# Altium schematic sheet Sheet_1.schdoc
size 605 x 619 mm
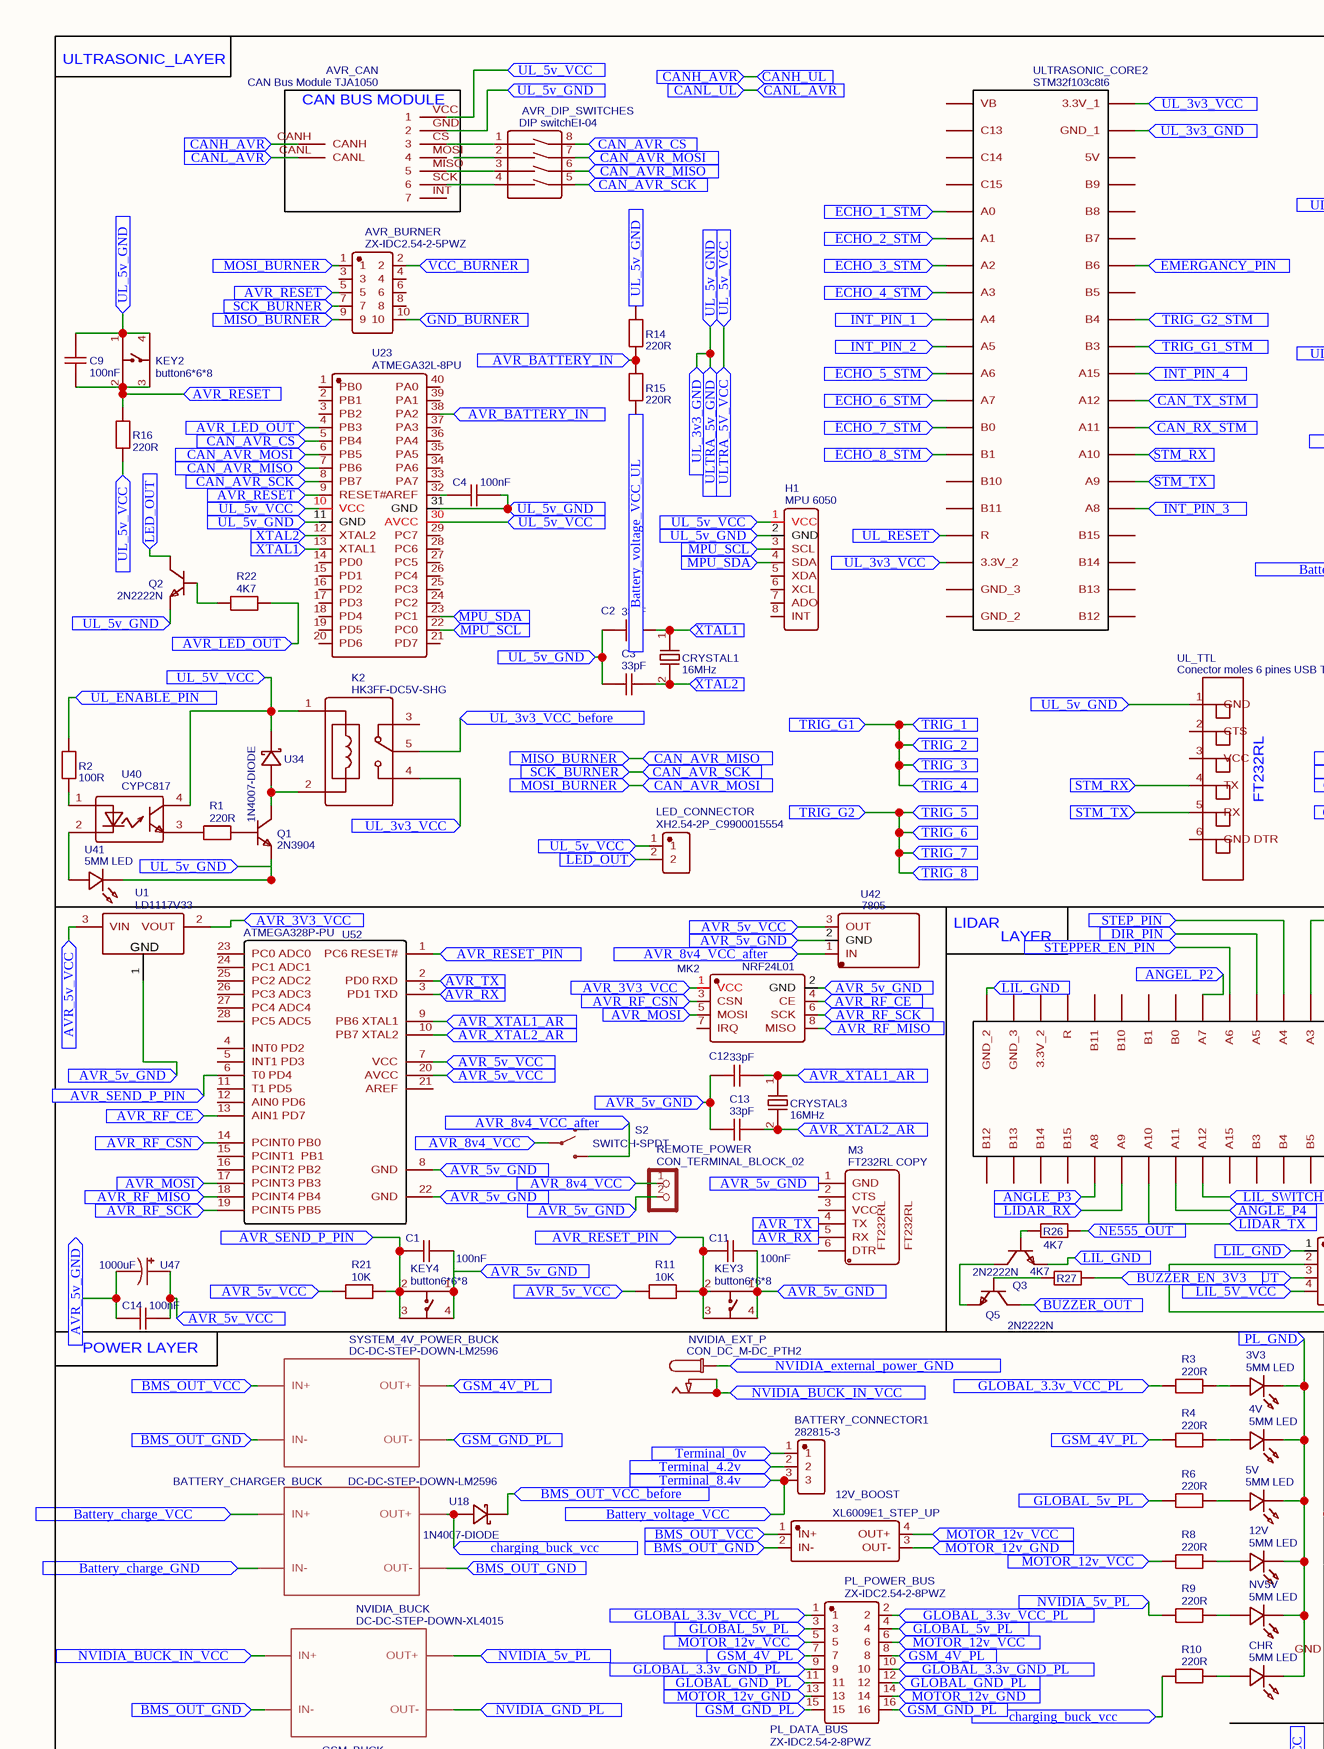
[diagram p0: Sheet_1.schdoc, top left]
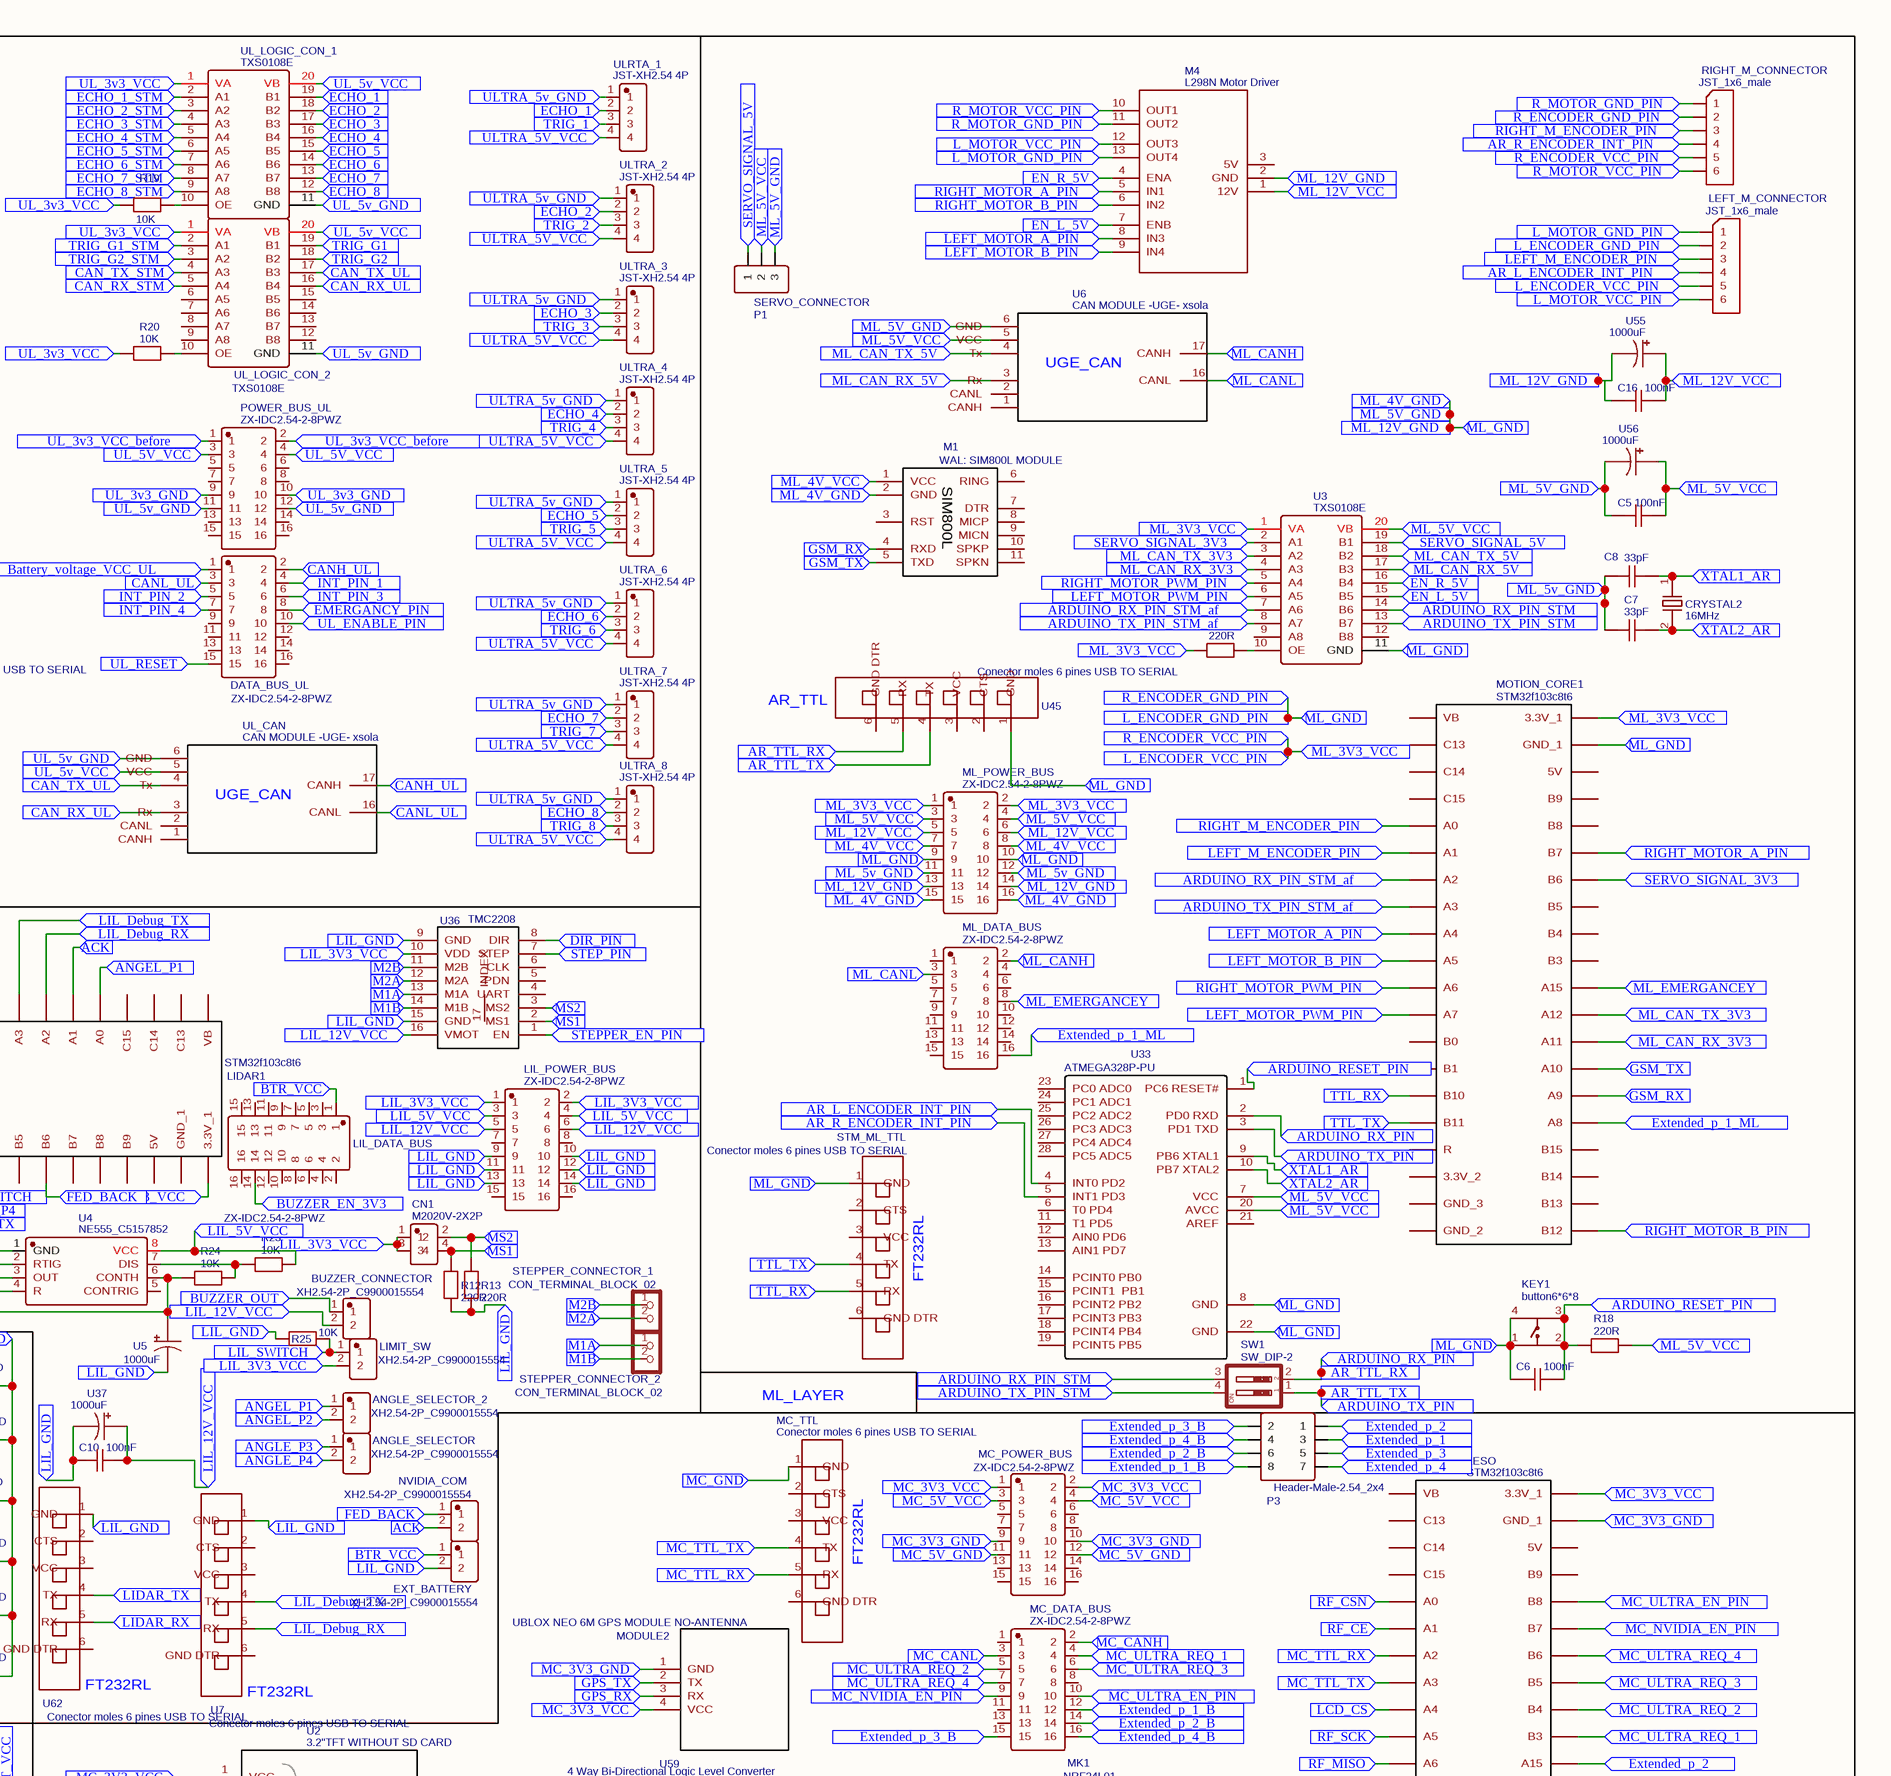
[diagram p1: Sheet_1.schdoc, top right]
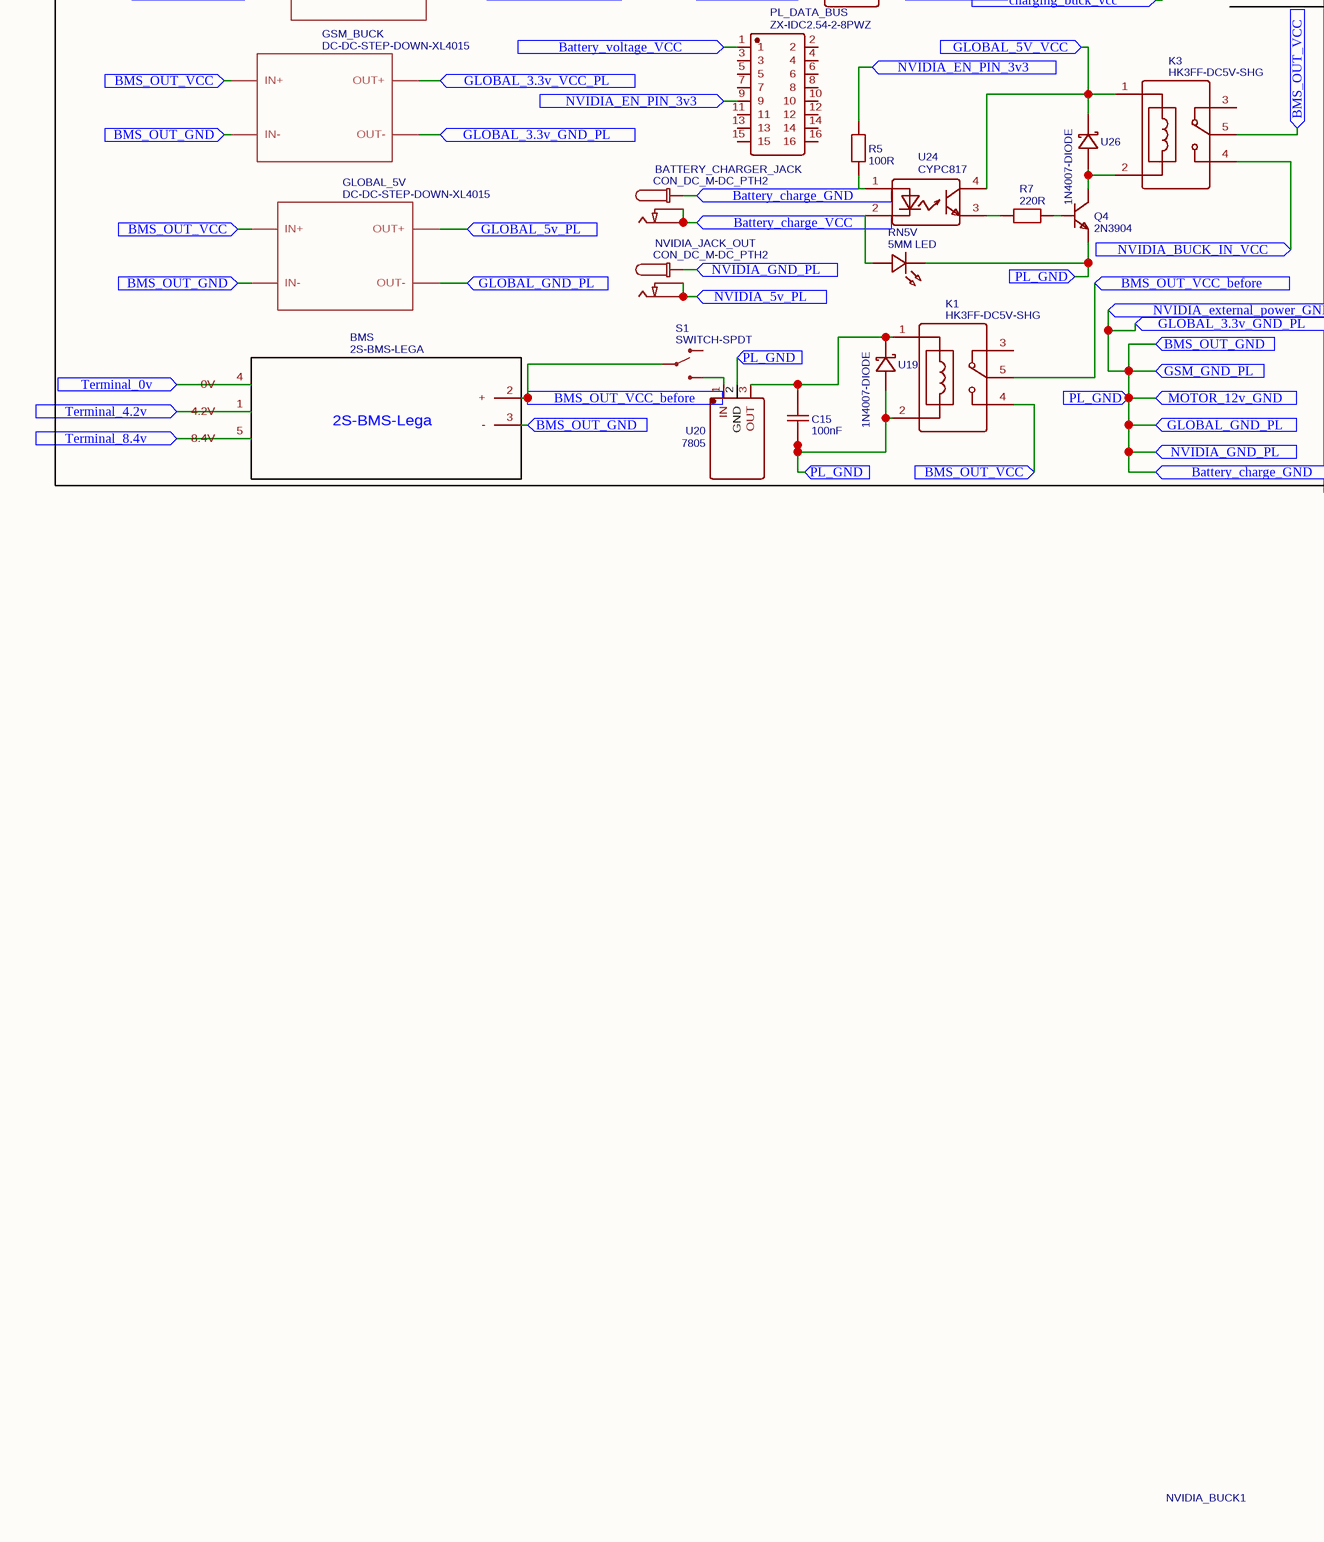
[diagram p2: Sheet_1.schdoc, bottom left]
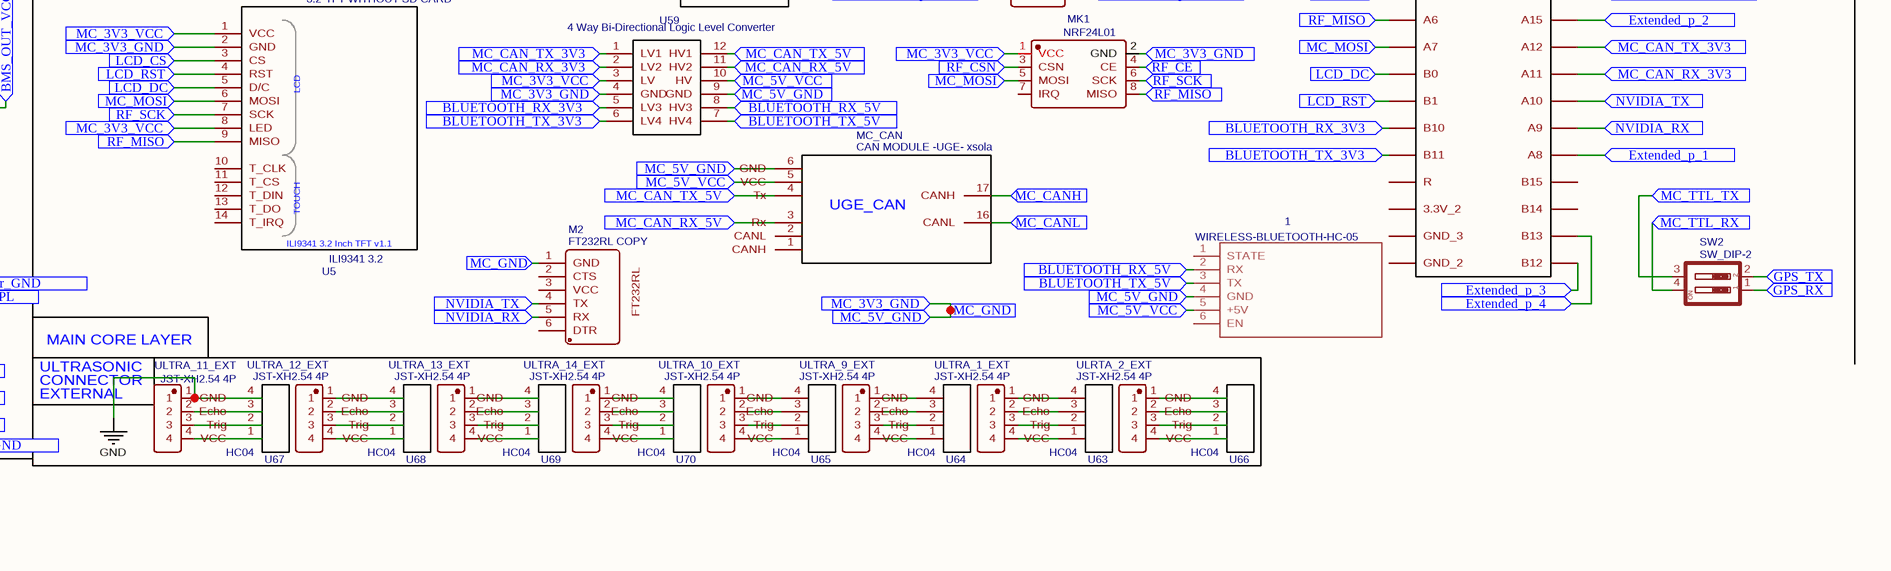
[diagram p3: Sheet_1.schdoc, bottom right]

## Parts
1  WIRELESS-BLUETOOTH-HC-05  [WIRELESS-BLUETOOTH-HC-05]
3V3  5MM LED  [LED-TH_BD5.0-P2.54-FD]
4V  5MM LED  [LED-TH_BD5.0-P2.54-FD]
5V  5MM LED  [LED-TH_BD5.0-P2.54-FD]
12V  5MM LED  [LED-TH_BD5.0-P2.54-FD]
12V_BOOST  XL6009E1_STEP_UP  [XL6009E1_STEP_UP]
ANGLE_SELECTOR  XH2.54-2P_C9900015554  [CONN-TH_XH2.54-2P]
ANGLE_SELECTOR_2  XH2.54-2P_C9900015554  [CONN-TH_XH2.54-2P]
AVR_BURNER  ZX-IDC2.54-2-5PWZ  [IDC-TH_10P-P2.54_ZX-IDC2.54-2-5PWZ]
AVR_CAN  CAN Bus Module TJA1050  [MCP2515_CAN_MODULE_BY0-10]
AVR_DIP_SWITCHES  DIP switchEI-04  [SW-TH_DIPSWITCHEI-04]
BATTERY_CHARGER_BUCK  DC-DC-STEP-DOWN-LM2596  [DC-DC-STEP-DOWN-LM2596]
BATTERY_CHARGER_JACK  CON_DC_M-DC_PTH2  [DC_BARREL_JACK_PTH_2MM_2]
BATTERY_CONNECTOR1  282815-3  [CONN-TH_3P-P5.08_TE_282815-3]
BMS  2S-BMS-LEGA  [2S_BMS_LEGA]
BUZZER_CONNECTOR  XH2.54-2P_C9900015554  [CONN-TH_XH2.54-2P]
C1  100nF  [CAP-TH_L3.8-W2.5-P2.54-D0.5]
C2  33pF  [CAP-TH_L3.8-W2.5-P2.54-D0.5]
C3  33pF  [CAP-TH_L3.8-W2.5-P2.54-D0.5]
C4  100nF  [CAP-TH_L3.8-W2.5-P2.54-D0.5]
C5  100nF  [CAP-TH_L3.8-W2.5-P2.54-D0.5]
C6  100nF  [CAP-TH_L3.8-W2.5-P2.54-D0.5]
C7  33pF  [CAP-TH_L3.8-W2.5-P2.54-D0.5]
C8  33pF  [CAP-TH_L3.8-W2.5-P2.54-D0.5]
C9  100nF  [CAP-TH_L3.8-W2.5-P2.54-D0.5]
C10  100nF  [CAP-TH_L3.8-W2.5-P2.54-D0.5]
C11  100nF  [CAP-TH_L3.8-W2.5-P2.54-D0.5]
C12  33pF  [CAP-TH_L3.8-W2.5-P2.54-D0.5]
C13  33pF  [CAP-TH_L3.8-W2.5-P2.54-D0.5]
C14  100nF  [CAP-TH_L3.8-W2.5-P2.54-D0.5]
C15  100nF  [CAP-TH_L3.8-W2.5-P2.54-D0.5]
C16  100nF  [CAP-TH_L3.8-W2.5-P2.54-D0.5]
CHR  5MM LED  [LED-TH_BD5.0-P2.54-FD]
CN1  M2020V-2X2P  [CONN-TH_M2020V-2X2P]
CRYSTAL1  16MHz  [CRYSTAL-TH_L10.8-W4.5-P4.88]
CRYSTAL2  16MHz  [CRYSTAL-TH_L10.8-W4.5-P4.88]
CRYSTAL3  16MHz  [CRYSTAL-TH_L10.8-W4.5-P4.88]
DATA_BUS_UL  ZX-IDC2.54-2-8PWZ  [IDC-TH_16P-P2.54_ZX-IDC2.54-2-8PWZ]
EXT_BATTERY  XH2.54-2P_C9900015554  [CONN-TH_XH2.54-2P]
GLOBAL_5V  DC-DC-STEP-DOWN-XL4015  [DC-DC-STEP-DOWN-XL4015]
GSM_BUCK  DC-DC-STEP-DOWN-XL4015  [DC-DC-STEP-DOWN-XL4015]
H1  MPU 6050  [MPU6050]
K1  HK3FF-DC5V-SHG  [RELAY-TH_HK3FF-DCXXV-1C]
K2  HK3FF-DC5V-SHG  [RELAY-TH_HK3FF-DCXXV-1C]
K3  HK3FF-DC5V-SHG  [RELAY-TH_HK3FF-DCXXV-1C]
KEY1  button6*6*8  [KEY-TH_4P-L6.0-W6.0-P4.50-LS7.5]
KEY2  button6*6*8  [KEY-TH_4P-L6.0-W6.0-P4.50-LS7.5]
KEY3  button6*6*8  [KEY-TH_4P-L6.0-W6.0-P4.50-LS7.5]
KEY4  button6*6*8  [KEY-TH_4P-L6.0-W6.0-P4.50-LS7.5]
LED_CONNECTOR  XH2.54-2P_C9900015554  [CONN-TH_XH2.54-2P]
LEFT_M_CONNECTOR  JST_1x6_male  [JST_XH_6PIN_2.54]
LESO  STM32f103c8t6  [STM32F103C8T6]
LIDAR1  STM32f103c8t6  [STM32F103C8T6]
LIL_DATA_BUS  ZX-IDC2.54-2-8PWZ  [IDC-TH_16P-P2.54_ZX-IDC2.54-2-8PWZ]
LIL_POWER_BUS  ZX-IDC2.54-2-8PWZ  [IDC-TH_16P-P2.54_ZX-IDC2.54-2-8PWZ]
LIMIT_SW  XH2.54-2P_C9900015554  [CONN-TH_XH2.54-2P]
M1  WAL: SIM800L MODULE  [WAL: SIM800L MODULE K]
M2  FT232RL COPY  [FT232RL]
M3  FT232RL COPY  [FT232RL]
M4  L298N Motor Driver  [L298N NI]
MC_CAN  CAN MODULE -UGE- xsola  [CAN MODULE -UGE-]
MC_DATA_BUS  ZX-IDC2.54-2-8PWZ  [IDC-TH_16P-P2.54_ZX-IDC2.54-2-8PWZ]
MC_POWER_BUS  ZX-IDC2.54-2-8PWZ  [IDC-TH_16P-P2.54_ZX-IDC2.54-2-8PWZ]
MC_TTL  Conector moles 6 pines USB TO SERIAL  [CONECTRO MOLEX 6 PINES FT232RL]
MK1  NRF24L01  [WIRELM-SMD_NRF24L01]
MK2  NRF24L01  [WIRELM-SMD_NRF24L01]
ML_DATA_BUS  ZX-IDC2.54-2-8PWZ  [IDC-TH_16P-P2.54_ZX-IDC2.54-2-8PWZ]
ML_POWER_BUS  ZX-IDC2.54-2-8PWZ  [IDC-TH_16P-P2.54_ZX-IDC2.54-2-8PWZ]
MODULE2  UBLOX NEO 6M GPS MODULE NO-ANTENNA  [UBLOX NEO 6M GPS MODULE]
MOTION_CORE1  STM32f103c8t6  [STM32F103C8T6]
NV5V  5MM LED  [LED-TH_BD5.0-P2.54-FD]
NVIDIA_BUCK  DC-DC-STEP-DOWN-XL4015  [DC-DC-STEP-DOWN-XL4015]
NVIDIA_COM  XH2.54-2P_C9900015554  [CONN-TH_XH2.54-2P]
NVIDIA_EXT_P  CON_DC_M-DC_PTH2  [DC_BARREL_JACK_PTH_2MM_2]
NVIDIA_JACK_OUT  CON_DC_M-DC_PTH2  [DC_BARREL_JACK_PTH_2MM_2]
P1  SERVO_CONNECTOR  [HDR-TH_3P-P2.54-V-F]
P3  Header-Male-2.54_2x4  [HDR-TH_8P-P2.54-V-M-R2-C4-S2.54]
PL_DATA_BUS  ZX-IDC2.54-2-8PWZ  [IDC-TH_16P-P2.54_ZX-IDC2.54-2-8PWZ]
PL_POWER_BUS  ZX-IDC2.54-2-8PWZ  [IDC-TH_16P-P2.54_ZX-IDC2.54-2-8PWZ]
POWER_BUS_UL  ZX-IDC2.54-2-8PWZ  [IDC-TH_16P-P2.54_ZX-IDC2.54-2-8PWZ]
Q1  2N3904  [TO-92-3_L5.1-W4.1-P1.27-L]
Q2  2N2222N  [2N2222N]
Q3  2N2222N  [2N2222N]
Q4  2N3904  [TO-92-3_L5.1-W4.1-P1.27-L]
Q5  2N2222N  [2N2222N]
R1  220R  [1/4 WATT RESISTOR]
R2  100R  [1/4 WATT RESISTOR]
R3  220R  [1/4 WATT RESISTOR]
R4  220R  [1/4 WATT RESISTOR]
R5  100R  [1/4 WATT RESISTOR]
R6  220R  [1/4 WATT RESISTOR]
R7  220R  [1/4 WATT RESISTOR]
R8  220R  [1/4 WATT RESISTOR]
R9  220R  [1/4 WATT RESISTOR]
R10  220R  [1/4 WATT RESISTOR]
R11  10K  [1/4 WATT RESISTOR]
R12  220R  [1/4 WATT RESISTOR]
R13  220R  [1/4 WATT RESISTOR]
R14  220R  [1/4 WATT RESISTOR]
R15  220R  [1/4 WATT RESISTOR]
R16  220R  [1/4 WATT RESISTOR]
R17  220R  [1/4 WATT RESISTOR]
R18  220R  [1/4 WATT RESISTOR]
R19  10K  [1/4 WATT RESISTOR]
R20  10K  [1/4 WATT RESISTOR]
R21  10K  [1/4 WATT RESISTOR]
R22  4K7  [1/4 WATT RESISTOR]
R23  10K  [1/4 WATT RESISTOR]
R24  10K  [1/4 WATT RESISTOR]
R25  10K  [1/4 WATT RESISTOR]
R26  4K7  [1/4 WATT RESISTOR]
R27  4K7  [1/4 WATT RESISTOR]
REMOTE_POWER  CON_TERMINAL_BLOCK_02  [TERMINAL_BLOCK_2P_5]
RIGHT_M_CONNECTOR  JST_1x6_male  [JST_XH_6PIN_2.54]
RN5V  5MM LED  [LED-TH_BD5.0-P2.54-FD]
S1  SWITCH-SPDT  [SWITCH-SPDT_KIT]
S2  SWITCH-SPDT  [SWITCH-SPDT_KIT]
STEPPER_CONNECTOR_1  CON_TERMINAL_BLOCK_02  [TERMINAL_BLOCK_2P_5]
STEPPER_CONNECTOR_2  CON_TERMINAL_BLOCK_02  [TERMINAL_BLOCK_2P_5]
STM_ML_TTL  Conector moles 6 pines USB TO SERIAL  [CONECTRO MOLEX 6 PINES FT232RL]
SW1  SW_DIP-2  [DIPSWITCH-02]
SW2  SW_DIP-2  [DIPSWITCH-02]
SYSTEM_4V_POWER_BUCK  DC-DC-STEP-DOWN-LM2596  [DC-DC-STEP-DOWN-LM2596]
U1  LD1117V33  [TO-220-3_L10.0-W4.5-P2.54-L]
U2  3.2"TFT WITHOUT SD CARD  [3.2INCH TFT MODIFIED]
U3  TXS0108E  [TXS0108E]
U4  NE555_C5157852  [DIP-8_L9.8-W6.4-P2.54-LS7.6-BL]
U5  1000uF  [CAP-TH_BD10.0-P5.00-D1.0-FD]
U6  CAN MODULE -UGE- xsola  [CAN MODULE -UGE-]
U7  Conector moles 6 pines USB TO SERIAL  [CONECTRO MOLEX 6 PINES FT232RL]
U18  1N4007-DIODE  [DO-41_BD2.4-L4.7-P8.70-D0.8-FD]
U19  1N4007-DIODE  [DO-41_BD2.4-L4.7-P8.70-D0.8-FD]
U20  7805  [TO-220-3_L10.0-W4.5-P2.54-L]
U23  ATMEGA32L-8PU  [PDIP-40_L52.3-W13.8-P2.54-LS15.2-BL]
U24  CYPC817  [DIP-4_L6.4-W4.6-P2.54-LS7.6-BL]
U26  1N4007-DIODE  [DO-41_BD2.4-L4.7-P8.70-D0.8-FD]
U33  ATMEGA328P-PU  [DIP-28_L34.6-W7.3-P2.54-LS10.2-BL]
U34  1N4007-DIODE  [DO-41_BD2.4-L4.7-P8.70-D0.8-FD]
U36  TMC2208  [TMC2208]
U37  1000uF  [CAP-TH_BD10.0-P5.00-D1.0-FD]
U40  CYPC817  [DIP-4_L6.4-W4.6-P2.54-LS7.6-BL]
U41  5MM LED  [LED-TH_BD5.0-P2.54-FD]
U42  7805  [TO-220-3_L10.0-W4.5-P2.54-L]
U45  Conector moles 6 pines USB TO SERIAL  [CONECTRO MOLEX 6 PINES FT232RL]
U47  1000uF  [CAP-TH_BD10.0-P5.00-D1.0-FD]
U52  ATMEGA328P-PU  [DIP-28_L34.6-W7.3-P2.54-LS10.2-BL]
U55  1000uF  [CAP-TH_BD10.0-P5.00-D1.0-FD]
U56  1000uF  [CAP-TH_BD10.0-P5.00-D1.0-FD]
U59  4 Way Bi-Directional Logic Level Converter  [LOGIC_LEVEL_CONVERTER_BI_DIRECT_4_CH]
U62  Conector moles 6 pines USB TO SERIAL  [CONECTRO MOLEX 6 PINES FT232RL]
U63  HC04  [HC04 HEADER]
U64  HC04  [HC04 HEADER]
U65  HC04  [HC04 HEADER]
U66  HC04  [HC04 HEADER]
U67  HC04  [HC04 HEADER]
U68  HC04  [HC04 HEADER]
U69  HC04  [HC04 HEADER]
U70  HC04  [HC04 HEADER]
UL_CAN  CAN MODULE -UGE- xsola  [CAN MODULE -UGE-]
UL_LOGIC_CON_1  TXS0108E  [TXS0108E]
UL_LOGIC_CON_2  TXS0108E  [TXS0108E]
UL_TTL  Conector moles 6 pines USB TO SERIAL  [CONECTRO MOLEX 6 PINES FT232RL]
ULRTA_1  JST-XH2.54 4P  [JST-XH2.54 4P]
ULRTA_2_EXT  JST-XH2.54 4P  [JST-XH2.54 4P]
ULTRA_1_EXT  JST-XH2.54 4P  [JST-XH2.54 4P]
ULTRA_2  JST-XH2.54 4P  [JST-XH2.54 4P]
ULTRA_3  JST-XH2.54 4P  [JST-XH2.54 4P]
ULTRA_4  JST-XH2.54 4P  [JST-XH2.54 4P]
ULTRA_5  JST-XH2.54 4P  [JST-XH2.54 4P]
ULTRA_6  JST-XH2.54 4P  [JST-XH2.54 4P]
ULTRA_7  JST-XH2.54 4P  [JST-XH2.54 4P]
ULTRA_8  JST-XH2.54 4P  [JST-XH2.54 4P]
ULTRA_9_EXT  JST-XH2.54 4P  [JST-XH2.54 4P]
ULTRA_10_EXT  JST-XH2.54 4P  [JST-XH2.54 4P]
ULTRA_11_EXT  JST-XH2.54 4P  [JST-XH2.54 4P]
ULTRA_12_EXT  JST-XH2.54 4P  [JST-XH2.54 4P]
ULTRA_13_EXT  JST-XH2.54 4P  [JST-XH2.54 4P]
ULTRA_14_EXT  JST-XH2.54 4P  [JST-XH2.54 4P]
ULTRASONIC_CORE2  STM32f103c8t6  [STM32F103C8T6]

## Blocks framed on the sheet
ULTRASONIC_LAYER: AVR_BURNER AVR_CAN AVR_DIP_SWITCHES C2-C4 C9 CRYSTAL1 DATA_BUS_UL H1 K2 KEY2 LED_CONNECTOR POWER_BUS_UL Q1 Q2 R1 R2 R14-R16 R19 R20 R22 U23 U34 U40 U41 UL_CAN UL_LOGIC_CON_1 UL_LOGIC_CON_2 UL_TTL ULRTA_1 ULTRA_2-ULTRA_8 ULTRASONIC_CORE2
ML_LAYER: C5-C8 C16 CRYSTAL2 KEY1 LEFT_M_CONNECTOR M1 M4 ML_DATA_BUS ML_POWER_BUS MOTION_CORE1 P1 R17 R18 RIGHT_M_CONNECTOR STM_ML_TTL SW1 U3 U6 U33 U45 U55 U56
POWER LAYER: 3V3 4V 5V 12V 12V_BOOST BATTERY_CHARGER_BUCK BATTERY_CHARGER_JACK BATTERY_CONNECTOR1 BMS C15 CHR GLOBAL_5V GSM_BUCK K1 K3 NV5V NVIDIA_BUCK NVIDIA_EXT_P NVIDIA_JACK_OUT PL_DATA_BUS PL_POWER_BUS Q4 R3-R10 RN5V S1 SYSTEM_4V_POWER_BUCK U18-U20 U24 U26

## Ports
ACK (in), ANGEL_P1 (in), ANGEL_P2 (in), ANGLE_P3 (in), ANGLE_P4 (in), AR_L_ENCODER_INT_PIN (in), AR_R_ENCODER_INT_PIN (in), AR_TTL_RX (in), AR_TTL_TX (in), ARDUINO_RESET_PIN (in), ARDUINO_RX_PIN (in), ARDUINO_RX_PIN_STM (in), ARDUINO_RX_PIN_STM_af (in), ARDUINO_TX_PIN (in), ARDUINO_TX_PIN_STM (in), ARDUINO_TX_PIN_STM_af (in), AVR_3V3_VCC (in), AVR_5v_GND (in), AVR_5v_VCC (in), AVR_8v4_VCC (in), AVR_8v4_VCC_after (in), AVR_BATTERY_IN (in), AVR_LED_OUT (in), AVR_MOSI (in), AVR_RESET (in), AVR_RESET_PIN (in), AVR_RF_CE (in), AVR_RF_CSN (in), AVR_RF_MISO (in), AVR_RF_SCK (in), AVR_RX (in), AVR_SEND_P_PIN (in), AVR_TX (in), AVR_XTAL1_AR (in), AVR_XTAL2_AR (in), Battery_charge_GND (in), Battery_charge_VCC (in), Battery_voltage_VCC (in), Battery_voltage_VCC_UL (in), BLUETOOTH_RX_3V3 (in), BLUETOOTH_RX_5V (in), BLUETOOTH_TX_3V3 (in), BLUETOOTH_TX_5V (in), BMS_OUT_GND (in), BMS_OUT_VCC (in), BMS_OUT_VCC_before (in), BTR_VCC (in), BUZZER_EN_3V3 (in), BUZZER_OUT (in), CAN_AVR_CS (in), CAN_AVR_MISO (in), CAN_AVR_MOSI (in), CAN_AVR_SCK (in), CAN_RX_STM (in), CAN_RX_UL (in), CAN_TX_STM (in), CAN_TX_UL (in), CANH_AVR (in), CANH_UL (in), CANL_AVR (in), CANL_UL (in), charging_buck_vcc (in), DIR_PIN (in), ECHO_1 (in), ECHO_1_STM (in), ECHO_2 (in), ECHO_2_STM (in), ECHO_3 (in), ECHO_3_STM (in), ECHO_4 (in), ECHO_4_STM (in), ECHO_5 (in), ECHO_5_STM (in), ECHO_6 (in), ECHO_6_STM (in), ECHO_7 (in), ECHO_7_STM (in), ECHO_8 (in), ECHO_8_STM (in), EMERGANCY_PIN (in), EN_L_5V (in), EN_R_5V (in), Extended_p_1 (in), Extended_p_1_B (in), Extended_p_1_ML (in), Extended_p_2 (in), Extended_p_2_B (in), Extended_p_3 (in), Extended_p_3_B (in), Extended_p_4 (in), Extended_p_4_B (in), FED_BACK (in), GLOBAL_3.3v_GND_PL (in), GLOBAL_3.3v_VCC_PL (in), GLOBAL_5v_PL (in), GLOBAL_5V_VCC (in), GLOBAL_GND_PL (in), GND_BURNER (in), GPS_RX (in), GPS_TX (in), GSM_4V_PL (in), GSM_GND_PL (in), GSM_RX (in), GSM_TX (in), INT_PIN_1 (in), INT_PIN_2 (in), INT_PIN_3 (in), INT_PIN_4 (in), L_ENCODER_GND_PIN (in), L_ENCODER_VCC_PIN (in), L_MOTOR_GND_PIN (in), L_MOTOR_VCC_PIN (in), LCD_CS (in), LCD_DC (in), LCD_RST (in), LED_OUT (in), LEFT_M_ENCODER_PIN (in), LEFT_MOTOR_A_PIN (in), LEFT_MOTOR_B_PIN (in), LEFT_MOTOR_PWM_PIN (in), LIDAR_RX (in), LIDAR_TX (in), LIL_3V3_VCC (in), LIL_5V_VCC (in), LIL_12V_VCC (in), LIL_Debug_RX (in), LIL_Debug_TX (in), LIL_GND (in), LIL_SWITCH (in), M1A (in), M1B (in), M2A (in), M2B (in), MC_3V3_GND (in), MC_3V3_VCC (in), MC_5V_GND (in), MC_5V_VCC (in), MC_CAN_RX_3V3 (in), MC_CAN_RX_5V (in), MC_CAN_TX_3V3 (in), MC_CAN_TX_5V (in), MC_CANH (in), MC_CANL (in), MC_GND (in), MC_MOSI (in), MC_NVIDIA_EN_PIN (in), MC_TTL_RX (in), MC_TTL_TX (in), MC_ULTRA_EN_PIN (in), MC_ULTRA_REQ_1 (in), MC_ULTRA_REQ_2 (in), MC_ULTRA_REQ_3 (in), MC_ULTRA_REQ_4 (in), MISO_BURNER (in), ML_3V3_VCC (in), ML_4V_GND (in), ML_4V_VCC (in), ML_5V_GND (in), ML_5v_GND (in), ML_5V_VCC (in), ML_12V_GND (in), ML_12V_VCC (in), ML_CAN_RX_3V3 (in), ML_CAN_RX_5V (in), ML_CAN_TX_3V3 (in), ML_CAN_TX_5V (in), ML_CANH (in), ML_CANL (in), ML_EMERGANCEY (in), ML_GND (in), MOSI_BURNER (in), MOTOR_12v_GND (in), MOTOR_12v_VCC (in), MPU_SCL (in), MPU_SDA (in), MS1 (in), MS2 (in), NE555_OUT (in), NVIDIA_5v_PL (in), NVIDIA_BUCK_IN_VCC (in), NVIDIA_EN_PIN_3v3 (in), NVIDIA_external_power_GND (in), NVIDIA_GND_PL (in), NVIDIA_RX (in), NVIDIA_TX (in), PL_GND (in), R_ENCODER_GND_PIN (in), R_ENCODER_VCC_PIN (in), R_MOTOR_GND_PIN (in), R_MOTOR_VCC_PIN (in), RF_CE (in), RF_CSN (in), RF_MISO (in), RF_SCK (in), RIGHT_M_ENCODER_PIN (in), RIGHT_MOTOR_A_PIN (in), RIGHT_MOTOR_B_PIN (in), RIGHT_MOTOR_PWM_PIN (in), SCK_BURNER (in), SERVO_SIGNAL_3V3 (in), SERVO_SIGNAL_5V (in), STEP_PIN (in), STEPPER_EN_PIN (in), STM_RX (in), STM_TX (in), Terminal_0v (in), Terminal_4.2v (in), Terminal_8.4v (in), TRIG_1 (in), TRIG_2 (in), TRIG_3 (in), TRIG_4 (in), TRIG_5 (in), TRIG_6 (in), TRIG_7 (in), TRIG_8 (in), TRIG_G1 (in), TRIG_G1_STM (in), TRIG_G2 (in), TRIG_G2_STM (in), TTL_RX (in), TTL_TX (in), UL_3v3_GND (in), UL_3v3_VCC (in), UL_3v3_VCC_before (in), UL_5v_GND (in), UL_5v_VCC (in), UL_5V_VCC (in), UL_ENABLE_PIN (in), UL_RESET (in), ULTRA_5v_GND (in), ULTRA_5V_VCC (in), VCC_BURNER (in), XTAL1 (in), XTAL1_AR (in), XTAL2 (in), XTAL2_AR (in)

## Nets
GND: U67.4(GND) ULTRA_11_EXT.1
ACK: LIDAR1.A1 NVIDIA_COM.2 ; port ACK
ANGEL_P1: ANGLE_SELECTOR_2.1 LIDAR1.A0 ; port ANGEL_P1
ANGEL_P2: ANGLE_SELECTOR_2.2 LIDAR1.A7 ; port ANGEL_P2
ANGLE_P3: ANGLE_SELECTOR.1 LIDAR1.A8 ; port ANGLE_P3
ANGLE_P4: ANGLE_SELECTOR.2 LIDAR1.A11 ; port ANGLE_P4
AR_L_ENCODER_INT_PIN: LEFT_M_CONNECTOR.4 U33.4(INT0_PD2) ; port AR_L_ENCODER_INT_PIN
AR_R_ENCODER_INT_PIN: RIGHT_M_CONNECTOR.4 U33.5(INT1_PD3) ; port AR_R_ENCODER_INT_PIN
AR_TTL_RX: SW1.2 U33.2(PD0_RXD) U45.5(RX) ; port AR_TTL_RX, port ARDUINO_RX_PIN
AR_TTL_TX: SW1.1 U33.3(PD1_TXD) U45.4(TX) ; port AR_TTL_TX, port ARDUINO_TX_PIN
ARDUINO_RESET_PIN: C6.1 KEY1.2 KEY1.3 R18.2 U33.1(PC6_RESET#) ; port ARDUINO_RESET_PIN
ARDUINO_RX_PIN_STM: SW1.3 U3.14(B6) ; port ARDUINO_RX_PIN_STM
ARDUINO_RX_PIN_STM_af: MOTION_CORE1.A2 U3.7(A6) ; port ARDUINO_RX_PIN_STM_af
ARDUINO_TX_PIN_STM: SW1.4 U3.13(B7) ; port ARDUINO_TX_PIN_STM
ARDUINO_TX_PIN_STM_af: MOTION_CORE1.A3 U3.8(A7) ; port ARDUINO_TX_PIN_STM_af
AVR_3V3_VCC: MK2.1(VCC) U1.2(VOUT) ; port AVR_3V3_VCC
AVR_5v_GND: C1.1 C11.1 C12.2 C13.2 C14.2 KEY3.1 KEY3.4 KEY4.1 KEY4.4 M3.1(GND) MK2.2(GND) REMOTE_POWER.2 U1.1(GND) U42.2(GND) U47.2 U52.8(GND) U52.22(GND) ; port AVR_5v_GND
AVR_5v_VCC: C14.1 R11.1 R21.1 U1.3(VIN) U42.3(OUT) U47.1 U52.7(VCC) U52.20(AVCC) ; port AVR_5v_VCC
AVR_8v4_VCC: REMOTE_POWER.1 S2.2(P) ; port AVR_8v4_VCC
AVR_8v4_VCC_after: S2.3(S) U42.1(IN) ; port AVR_8v4_VCC_after
AVR_BATTERY_IN: R14.2 R15.1 U23.38(PA2) ; port AVR_BATTERY_IN
AVR_LED_OUT: R22.2 U23.4(PB3) ; port AVR_LED_OUT
AVR_MOSI: MK2.5(MOSI) U52.17(PCINT3_PB3) ; port AVR_MOSI
AVR_RESET: AVR_BURNER.5 C9.1 KEY2.2 KEY2.3 R16.1 U23.9(RESET#) ; port AVR_RESET
AVR_RESET_PIN: C11.2 KEY3.2 KEY3.3 R11.2 U52.1(PC6_RESET#) ; port AVR_RESET_PIN
AVR_RF_CE: MK2.4(CE) U52.13(AIN1_PD7) ; port AVR_RF_CE
AVR_RF_CSN: MK2.3(CSN) U52.14(PCINT0_PB0) ; port AVR_RF_CSN
AVR_RF_MISO: MK2.8(MISO) U52.18(PCINT4_PB4) ; port AVR_RF_MISO
AVR_RF_SCK: MK2.6(SCK) U52.19(PCINT5_PB5) ; port AVR_RF_SCK
AVR_RX: M3.5(RX) U52.3(PD1_TXD) ; port AVR_RX
AVR_SEND_P_PIN: C1.2 KEY4.2 KEY4.3 R21.2 U52.6(T0_PD4) ; port AVR_SEND_P_PIN
AVR_TX: M3.4(TX) U52.2(PD0_RXD) ; port AVR_TX
AVR_XTAL1_AR: C12.1 CRYSTAL3.1 U52.9(PB6_XTAL1) ; port AVR_XTAL1_AR
AVR_XTAL2_AR: C13.1 CRYSTAL3.2 U52.10(PB7_XTAL2) ; port AVR_XTAL2_AR
Battery_charge_GND: 3V3.2(-) 4V.2(-) 5V.2(-) 12V.2(-) 12V_BOOST.2(IN-) 12V_BOOST.3(OUT-) BATTERY_CHARGER_BUCK.IN- BATTERY_CHARGER_BUCK.OUT- BATTERY_CHARGER_JACK.P1 BMS.3(-) C15.1 CHR.2(-) GLOBAL_5V.IN- GLOBAL_5V.OUT- GSM_BUCK.IN- GSM_BUCK.OUT- K1.2 NV5V.2(-) NVIDIA_BUCK.IN- NVIDIA_BUCK.OUT- NVIDIA_EXT_P.P1 NVIDIA_JACK_OUT.P1 PL_POWER_BUS.9 PL_POWER_BUS.10 PL_POWER_BUS.11 PL_POWER_BUS.12 PL_POWER_BUS.13 PL_POWER_BUS.14 PL_POWER_BUS.15 PL_POWER_BUS.16 Q4.1(E) RN5V.2(-) SYSTEM_4V_POWER_BUCK.IN- SYSTEM_4V_POWER_BUCK.OUT- U19.1(A) U20.2(GND) ; port BMS_OUT_GND, port Battery_charge_GND, port NVIDIA_GND_PL, port GLOBAL_3.3v_GND_PL, port GLOBAL_GND_PL, port MOTOR_12v_GND, port PL_GND, port GSM_GND_PL, port NVIDIA_external_power_GND
Battery_charge_VCC: BATTERY_CHARGER_BUCK.IN+ BATTERY_CHARGER_JACK.P2(P3) BATTERY_CHARGER_JACK.P3(P2) ; port Battery_charge_VCC
Battery_voltage_VCC: BATTERY_CONNECTOR1.3 BMS.5(8.4V) PL_DATA_BUS.1 ; port Terminal_8.4v, port Battery_voltage_VCC
Battery_voltage_VCC_UL: DATA_BUS_UL.1 R15.2 ; port Battery_voltage_VCC_UL
BLUETOOTH_RX_3V3: LESO.B10 U59.5(LV3) ; port BLUETOOTH_RX_3V3
BLUETOOTH_RX_5V: 1.2(RX) U59.8(HV3) ; port BLUETOOTH_RX_5V
BLUETOOTH_TX_3V3: LESO.B11 U59.6(LV4) ; port BLUETOOTH_TX_3V3
BLUETOOTH_TX_5V: 1.3(TX) U59.7(HV4) ; port BLUETOOTH_TX_5V
BMS_OUT_VCC: 12V_BOOST.1(IN+) GLOBAL_5V.IN+ GSM_BUCK.IN+ K1.4 K3.5 SYSTEM_4V_POWER_BUCK.IN+ ; port BMS_OUT_VCC
BMS_OUT_VCC_before: BMS.2(+) K1.5 S1.2(P) U18.2(K) ; port BMS_OUT_VCC_before
BTR_VCC: EXT_BATTERY.1 LIL_DATA_BUS.1 ; port BTR_VCC
BUZZER_EN_3V3: LIL_DATA_BUS.14 R27.2 ; port BUZZER_EN_3V3
BUZZER_OUT: BUZZER_CONNECTOR.1 Q5.3(C) ; port BUZZER_OUT
CAN_AVR_CS: AVR_DIP_SWITCHES.8 U23.5(PB4) ; port CAN_AVR_CS
CAN_AVR_MISO: AVR_BURNER.9 AVR_DIP_SWITCHES.6 U23.7(PB6) ; port MISO_BURNER, port CAN_AVR_MISO
CAN_AVR_MOSI: AVR_BURNER.1 AVR_DIP_SWITCHES.7 U23.6(PB5) ; port MOSI_BURNER, port CAN_AVR_MOSI
CAN_AVR_SCK: AVR_BURNER.7 AVR_DIP_SWITCHES.5 U23.8(PB7) ; port SCK_BURNER, port CAN_AVR_SCK
CAN_RX_STM: UL_LOGIC_CON_2.5(A4) ULTRASONIC_CORE2.A11 ; port CAN_RX_STM
CAN_RX_UL: UL_CAN.3(Rx) UL_LOGIC_CON_2.16(B4) ; port CAN_RX_UL
CAN_TX_STM: UL_LOGIC_CON_2.4(A3) ULTRASONIC_CORE2.A12 ; port CAN_TX_STM
CAN_TX_UL: UL_CAN.4(Tx) UL_LOGIC_CON_2.17(B3) ; port CAN_TX_UL
CANH_AVR: AVR_CAN.CANH DATA_BUS_UL.2 UL_CAN.17(CANH) ; port CANH_UL, port CANH_AVR
CANL_AVR: AVR_CAN.CANL DATA_BUS_UL.3 UL_CAN.16(CANL) ; port CANL_UL, port CANL_AVR
charging_buck_vcc: BATTERY_CHARGER_BUCK.OUT+ R10.1 U18.1(A) ; port charging_buck_vcc
DIR_PIN: LIDAR1.A5 U36.8(DIR) ; port DIR_PIN
ECHO_1: UL_LOGIC_CON_1.19(B1) ULRTA_1.2 ; port ECHO_1
ECHO_1_STM: UL_LOGIC_CON_1.2(A1) ULTRASONIC_CORE2.A0 ; port ECHO_1_STM
ECHO_2: UL_LOGIC_CON_1.18(B2) ULTRA_2.2 ; port ECHO_2
ECHO_2_STM: UL_LOGIC_CON_1.3(A2) ULTRASONIC_CORE2.A1 ; port ECHO_2_STM
ECHO_3: UL_LOGIC_CON_1.17(B3) ULTRA_3.2 ; port ECHO_3
ECHO_3_STM: UL_LOGIC_CON_1.4(A3) ULTRASONIC_CORE2.A2 ; port ECHO_3_STM
ECHO_4: UL_LOGIC_CON_1.16(B4) ULTRA_4.2 ; port ECHO_4
ECHO_4_STM: UL_LOGIC_CON_1.5(A4) ULTRASONIC_CORE2.A3 ; port ECHO_4_STM
ECHO_5: UL_LOGIC_CON_1.15(B5) ULTRA_5.2 ; port ECHO_5
ECHO_5_STM: UL_LOGIC_CON_1.6(A5) ULTRASONIC_CORE2.A6 ; port ECHO_5_STM
ECHO_6: UL_LOGIC_CON_1.14(B6) ULTRA_6.2 ; port ECHO_6
ECHO_6_STM: UL_LOGIC_CON_1.7(A6) ULTRASONIC_CORE2.A7 ; port ECHO_6_STM
ECHO_7: UL_LOGIC_CON_1.13(B7) ULTRA_7.2 ; port ECHO_7
ECHO_7_STM: UL_LOGIC_CON_1.8(A7) ULTRASONIC_CORE2.B0 ; port ECHO_7_STM
ECHO_8: UL_LOGIC_CON_1.12(B8) ULTRA_8.2 ; port ECHO_8
ECHO_8_STM: UL_LOGIC_CON_1.9(A8) ULTRASONIC_CORE2.B1 ; port ECHO_8_STM
EMERGANCY_PIN: DATA_BUS_UL.8 ULTRASONIC_CORE2.B6 ; port EMERGANCY_PIN
EN_L_5V: M4.7(ENB) U3.15(B5) ; port EN_L_5V
EN_R_5V: M4.4(ENA) U3.16(B4) ; port EN_R_5V
Extended_p_1: LESO.A8 P3.3 ; port Extended_p_1
Extended_p_1_B: MC_DATA_BUS.12 P3.8 ; port Extended_p_1_B
Extended_p_1_ML: ML_DATA_BUS.16 MOTION_CORE1.A8 ; port Extended_p_1_ML
Extended_p_2: LESO.A15 P3.1 ; port Extended_p_2
Extended_p_2_B: MC_DATA_BUS.14 P3.6 ; port Extended_p_2_B
Extended_p_3: LESO.B12 P3.5 ; port Extended_p_3
Extended_p_3_B: MC_DATA_BUS.15 P3.2 ; port Extended_p_3_B
Extended_p_4: LESO.B13 P3.7 ; port Extended_p_4
Extended_p_4_B: MC_DATA_BUS.16 P3.4 ; port Extended_p_4_B
FED_BACK: LIDAR1.A12 LIDAR1.B6 LIMIT_SW.1 NVIDIA_COM.1 R25.2 ; port FED_BACK, port LIL_SWITCH
GLOBAL_3.3v_VCC_PL: GSM_BUCK.OUT+ PL_POWER_BUS.1 PL_POWER_BUS.2 R3.1 ; port GLOBAL_3.3v_VCC_PL
GLOBAL_5v_PL: GLOBAL_5V.OUT+ PL_POWER_BUS.3 PL_POWER_BUS.4 R6.1 ; port GLOBAL_5v_PL
GLOBAL_5V_VCC: K3.1 U24.4(COL) U26.2(K) ; port GLOBAL_5V_VCC
GND_BURNER: AVR_BURNER.10 ; port GND_BURNER
GPS_RX: MODULE2.3(RX) SW2.1 ; port GPS_RX
GPS_TX: MODULE2.2(TX) SW2.2 ; port GPS_TX
GSM_4V_PL: PL_POWER_BUS.7 PL_POWER_BUS.8 R4.1 SYSTEM_4V_POWER_BUCK.OUT+ ; port GSM_4V_PL
GSM_RX: M1.4(RXD) MOTION_CORE1.A9 ; port GSM_RX
GSM_TX: M1.5(TXD) MOTION_CORE1.A10 ; port GSM_TX
INT_PIN_1: DATA_BUS_UL.4 ULTRASONIC_CORE2.A4 ; port INT_PIN_1
INT_PIN_2: DATA_BUS_UL.5 ULTRASONIC_CORE2.A5 ; port INT_PIN_2
INT_PIN_3: DATA_BUS_UL.6 ULTRASONIC_CORE2.A8 ; port INT_PIN_3
INT_PIN_4: DATA_BUS_UL.7 ULTRASONIC_CORE2.A15 ; port INT_PIN_4
L_ENCODER_GND_PIN: C5.2 C6.2 C7.2 C8.2 C16.2 KEY1.1 KEY1.4 LEFT_M_CONNECTOR.2 M1.2(GND) M4.2(GND) ML_POWER_BUS.9 ML_POWER_BUS.10 ML_POWER_BUS.11 ML_POWER_BUS.12 ML_POWER_BUS.13 ML_POWER_BUS.14 ML_POWER_BUS.15 ML_POWER_BUS.16 MOTION_CORE1.GND_1 P1.3 RIGHT_M_CONNECTOR.2 STM_ML_TTL.1(GND) U3.11(GND) U6.6(GND) U33.8(GND) U33.22(GND) U45.1(GND) U55.2 U56.2 ; port R_ENCODER_GND_PIN, port L_ENCODER_GND_PIN, port ML_12V_GND, port ML_5V_GND, port ML_4V_GND, port ML_GND, port ML_5v_GND
L_ENCODER_VCC_PIN: LEFT_M_CONNECTOR.5 ML_POWER_BUS.1 ML_POWER_BUS.2 MOTION_CORE1.3.3V_1 R17.2 RIGHT_M_CONNECTOR.5 U3.1(VA) ; port R_ENCODER_VCC_PIN, port L_ENCODER_VCC_PIN, port ML_3V3_VCC
L_MOTOR_GND_PIN: LEFT_M_CONNECTOR.1 M4.13(OUT4) ; port L_MOTOR_GND_PIN
L_MOTOR_VCC_PIN: LEFT_M_CONNECTOR.6 M4.12(OUT3) ; port L_MOTOR_VCC_PIN
LCD_CS: LESO.A4 U2.3(CS) ; port LCD_CS
LCD_DC: LESO.B0 U2.5(D/C) ; port LCD_DC
LCD_RST: LESO.B1 U2.4(RST) ; port LCD_RST
LED_OUT: LED_CONNECTOR.2 Q2.3(C) ; port LED_OUT
LEFT_M_ENCODER_PIN: LEFT_M_CONNECTOR.3 MOTION_CORE1.A1 ; port LEFT_M_ENCODER_PIN
LEFT_MOTOR_A_PIN: M4.8(IN3) MOTION_CORE1.A4 ; port LEFT_MOTOR_A_PIN
LEFT_MOTOR_B_PIN: M4.9(IN4) MOTION_CORE1.A5 ; port LEFT_MOTOR_B_PIN
LEFT_MOTOR_PWM_PIN: MOTION_CORE1.A7 U3.6(A5) ; port LEFT_MOTOR_PWM_PIN
LIDAR_RX: LIDAR1.A9 U62.5(RX) ; port LIDAR_RX
LIDAR_TX: LIDAR1.A10 U62.4(TX) ; port LIDAR_TX
LIL_3V3_VCC: CN1.1 CN1.3 LIDAR1.3.3V_1 LIL_POWER_BUS.1 LIL_POWER_BUS.2 LIMIT_SW.2 U36.10(VDD) ; port LIL_3V3_VCC
LIL_5V_VCC: LIL_POWER_BUS.3 LIL_POWER_BUS.4 R23.2 U4.4(R) U4.8(VCC) ; port LIL_5V_VCC
LIL_12V_VCC: BUZZER_CONNECTOR.2 C10.1 LIL_POWER_BUS.5 LIL_POWER_BUS.6 U36.16(VMOT) U37.1 ; port LIL_12V_VCC
LIL_Debug_RX: LIDAR1.A2 U7.5(RX) ; port LIL_Debug_RX
LIL_Debug_TX: LIDAR1.A3 U7.4(TX) ; port LIL_Debug_TX
LIL_GND: C10.2 EXT_BATTERY.2 LIDAR1.GND_2 LIL_POWER_BUS.9 LIL_POWER_BUS.10 LIL_POWER_BUS.11 LIL_POWER_BUS.12 LIL_POWER_BUS.13 LIL_POWER_BUS.14 Q3.1(E) R12.2 R13.2 R25.1 U4.1(GND) U5.2 U7.1(GND) U36.9(GND) U36.15(GND) U37.2 U62.1(GND) ; port LIL_GND
M1A: STEPPER_CONNECTOR_2.1 U36.13(M1A) ; port M1A
M1B: STEPPER_CONNECTOR_2.2 U36.14(M1B) ; port M1B
M2A: STEPPER_CONNECTOR_1.2 U36.12(M2A) ; port M2A
M2B: STEPPER_CONNECTOR_1.1 U36.11(M2B) ; port M2B
MC_3V3_GND: 1.4(GND) LESO.GND_1 M2.1(GND) MC_CAN.6(GND) MC_POWER_BUS.9 MC_POWER_BUS.10 MC_POWER_BUS.11 MC_POWER_BUS.12 MC_TTL.1(GND) MK1.2(GND) MODULE2.1(GND) U2.2(GND) U59.4(GND) U59.9(GND) ; port MC_3V3_GND, port MC_5V_GND, port MC_GND
MC_3V3_VCC: LESO.3.3V_1 MC_POWER_BUS.1 MC_POWER_BUS.2 MK1.1(VCC) MODULE2.4(VCC) U2.1(VCC) U2.8(LED) U59.3(LV) ; port MC_3V3_VCC
MC_5V_VCC: 1.5(+5V) MC_CAN.5(VCC) MC_POWER_BUS.3 MC_POWER_BUS.4 U59.10(HV) ; port MC_5V_VCC
MC_CAN_RX_3V3: LESO.A11 U59.2(LV2) ; port MC_CAN_RX_3V3
MC_CAN_RX_5V: MC_CAN.3(Rx) U59.11(HV2) ; port MC_CAN_RX_5V
MC_CAN_TX_3V3: LESO.A12 U59.1(LV1) ; port MC_CAN_TX_3V3
MC_CAN_TX_5V: MC_CAN.4(Tx) U59.12(HV1) ; port MC_CAN_TX_5V
MC_CANH: MC_CAN.17(CANH) MC_DATA_BUS.2 ; port MC_CANH
MC_CANL: MC_CAN.16(CANL) MC_DATA_BUS.3 ; port MC_CANL
MC_MOSI: LESO.A7 MK1.5(MOSI) U2.6(MOSI) ; port MC_MOSI
MC_NVIDIA_EN_PIN: LESO.B7 MC_DATA_BUS.9 ; port MC_NVIDIA_EN_PIN
MC_TTL_RX: LESO.A2 MC_TTL.5(RX) SW2.4 ; port MC_TTL_RX
MC_TTL_TX: LESO.A3 MC_TTL.4(TX) SW2.3 ; port MC_TTL_TX
MC_ULTRA_EN_PIN: LESO.B8 MC_DATA_BUS.10 ; port MC_ULTRA_EN_PIN
MC_ULTRA_REQ_1: LESO.B3 MC_DATA_BUS.4 ; port MC_ULTRA_REQ_1
MC_ULTRA_REQ_2: LESO.B4 MC_DATA_BUS.5 ; port MC_ULTRA_REQ_2
MC_ULTRA_REQ_3: LESO.B5 MC_DATA_BUS.6 ; port MC_ULTRA_REQ_3
MC_ULTRA_REQ_4: LESO.B6 MC_DATA_BUS.7 ; port MC_ULTRA_REQ_4
ML_4V_VCC: M1.1(VCC) ML_POWER_BUS.7 ML_POWER_BUS.8 ; port ML_4V_VCC
ML_5V_VCC: C5.1 ML_POWER_BUS.3 ML_POWER_BUS.4 P1.2 R18.1 U3.20(VB) U6.5(VCC) U33.7(VCC) U33.20(AVCC) U56.1 ; port ML_5V_VCC
ML_12V_VCC: C16.1 M4.1(12V) ML_POWER_BUS.5 ML_POWER_BUS.6 U55.1 ; port ML_12V_VCC
ML_CAN_RX_3V3: MOTION_CORE1.A11 U3.4(A3) ; port ML_CAN_RX_3V3
ML_CAN_RX_5V: U3.17(B3) U6.3(Rx) ; port ML_CAN_RX_5V
ML_CAN_TX_3V3: MOTION_CORE1.A12 U3.3(A2) ; port ML_CAN_TX_3V3
ML_CAN_TX_5V: U3.18(B2) U6.4(Tx) ; port ML_CAN_TX_5V
ML_CANH: ML_DATA_BUS.2 U6.17(CANH) ; port ML_CANH
ML_CANL: ML_DATA_BUS.3 U6.16(CANL) ; port ML_CANL
ML_EMERGANCEY: ML_DATA_BUS.8 MOTION_CORE1.A15 ; port ML_EMERGANCEY
MOTOR_12v_VCC: 12V_BOOST.4(OUT+) PL_POWER_BUS.5 PL_POWER_BUS.6 R8.1 ; port MOTOR_12v_VCC
MPU_SCL: H1.3(SCL) U23.22(PC0) ; port MPU_SCL
MPU_SDA: H1.4(SDA) U23.23(PC1) ; port MPU_SDA
MS1: CN1.4 R12.1 U36.2(MS1) ; port MS1
MS2: CN1.2 R13.1 U36.3(MS2) ; port MS2
NE555_OUT: R26.2 U4.3(OUT) ; port NE555_OUT
NVIDIA_5v_PL: NVIDIA_BUCK.OUT+ NVIDIA_JACK_OUT.P2(P3) NVIDIA_JACK_OUT.P3(P2) R9.1 ; port NVIDIA_5v_PL
NVIDIA_BUCK_IN_VCC: K3.4 NVIDIA_BUCK.IN+ NVIDIA_EXT_P.P2(P3) NVIDIA_EXT_P.P3(P2) ; port NVIDIA_BUCK_IN_VCC
NVIDIA_EN_PIN_3v3: PL_DATA_BUS.9 R5.1 ; port NVIDIA_EN_PIN_3v3
NVIDIA_RX: LESO.A9 M2.5(RX) ; port NVIDIA_RX
NVIDIA_TX: LESO.A10 M2.4(TX) ; port NVIDIA_TX
R_MOTOR_GND_PIN: M4.11(OUT2) RIGHT_M_CONNECTOR.1 ; port R_MOTOR_GND_PIN
R_MOTOR_VCC_PIN: M4.10(OUT1) RIGHT_M_CONNECTOR.6 ; port R_MOTOR_VCC_PIN
RF_CE: LESO.A1 MK1.4(CE) ; port RF_CE
RF_CSN: LESO.A0 MK1.3(CSN) ; port RF_CSN
RF_MISO: LESO.A6 MK1.8(MISO) U2.9(MISO) ; port RF_MISO
RF_SCK: LESO.A5 MK1.6(SCK) U2.7(SCK) ; port RF_SCK
RIGHT_M_ENCODER_PIN: MOTION_CORE1.A0 RIGHT_M_CONNECTOR.3 ; port RIGHT_M_ENCODER_PIN
RIGHT_MOTOR_A_PIN: M4.5(IN1) MOTION_CORE1.B7 ; port RIGHT_MOTOR_A_PIN
RIGHT_MOTOR_B_PIN: M4.6(IN2) MOTION_CORE1.B12 ; port RIGHT_MOTOR_B_PIN
RIGHT_MOTOR_PWM_PIN: MOTION_CORE1.A6 U3.5(A4) ; port RIGHT_MOTOR_PWM_PIN
SERVO_SIGNAL_3V3: MOTION_CORE1.B6 U3.2(A1) ; port SERVO_SIGNAL_3V3
SERVO_SIGNAL_5V: P1.1 U3.19(B1) ; port SERVO_SIGNAL_5V
STEP_PIN: LIDAR1.A4 U36.7(STEP) ; port STEP_PIN
STEPPER_EN_PIN: LIDAR1.A6 U36.1(EN) ; port STEPPER_EN_PIN
STM_RX: UL_TTL.4(TX) ULTRASONIC_CORE2.A10 ; port STM_RX
STM_TX: UL_TTL.5(RX) ULTRASONIC_CORE2.A9 ; port STM_TX
Terminal_0v: BATTERY_CONNECTOR1.1 BMS.4(0V) ; port Terminal_0v
Terminal_4.2v: BATTERY_CONNECTOR1.2 BMS.1(4.2V) ; port Terminal_4.2v
TRIG_1: UL_LOGIC_CON_2.19(B1) ULRTA_1.3 ULTRA_2.3 ULTRA_3.3 ULTRA_4.3 ; port TRIG_1, port TRIG_2, port TRIG_3, port TRIG_4, port TRIG_G1
TRIG_5: UL_LOGIC_CON_2.18(B2) ULTRA_5.3 ULTRA_6.3 ULTRA_7.3 ULTRA_8.3 ; port TRIG_5, port TRIG_6, port TRIG_7, port TRIG_8, port TRIG_G2
TRIG_G1_STM: UL_LOGIC_CON_2.2(A1) ULTRASONIC_CORE2.B3 ; port TRIG_G1_STM
TRIG_G2_STM: UL_LOGIC_CON_2.3(A2) ULTRASONIC_CORE2.B4 ; port TRIG_G2_STM
TTL_RX: MOTION_CORE1.B10 STM_ML_TTL.5(RX) ; port TTL_RX
TTL_TX: MOTION_CORE1.B11 STM_ML_TTL.4(TX) ; port TTL_TX
UL_3v3_GND: AVR_CAN.GND(2) C2.2 C3.2 C4.1 C9.2 H1.2(GND) KEY2.1 KEY2.4 POWER_BUS_UL.9 POWER_BUS_UL.10 POWER_BUS_UL.11 POWER_BUS_UL.12 Q1.1(E) Q2.1(E) R14.1 U23.11(GND) U23.31(GND) U41.2(-) UL_CAN.6(GND) UL_LOGIC_CON_1.11(GND) UL_LOGIC_CON_2.11(GND) UL_TTL.1(GND) ULRTA_1.1 ULTRA_2.1 ULTRA_3.1 ULTRA_4.1 ULTRA_5.1 ULTRA_6.1 ULTRA_7.1 ULTRA_8.1 ULTRASONIC_CORE2.GND_1 ; port ULTRA_5v_GND, port UL_5v_GND, port UL_3v3_GND
UL_3v3_VCC: K2.4 R19.1 R20.1 UL_LOGIC_CON_1.1(VA) UL_LOGIC_CON_2.1(VA) ULTRASONIC_CORE2.3.3V_1 ULTRASONIC_CORE2.3.3V_2 ; port UL_3v3_VCC
UL_3v3_VCC_before: K2.5 POWER_BUS_UL.1 POWER_BUS_UL.2 ; port UL_3v3_VCC_before
UL_5v_VCC: AVR_CAN.VCC(1) H1.1(VCC) LED_CONNECTOR.1 POWER_BUS_UL.3 POWER_BUS_UL.4 R16.2 U23.10(VCC) U23.30(AVCC) U34.2(K) U40.4(COL) UL_CAN.5(VCC) UL_LOGIC_CON_1.20(VB) UL_LOGIC_CON_2.20(VB) ULRTA_1.4 ULTRA_2.4 ULTRA_3.4 ULTRA_4.4 ULTRA_5.4 ULTRA_6.4 ULTRA_7.4 ULTRA_8.4 ; port ULTRA_5V_VCC, port UL_5v_VCC, port UL_5V_VCC
UL_ENABLE_PIN: DATA_BUS_UL.10 R2.1 ; port UL_ENABLE_PIN
UL_RESET: DATA_BUS_UL.15 ULTRASONIC_CORE2.R ; port UL_RESET
VCC_BURNER: AVR_BURNER.2 ; port VCC_BURNER
XTAL1: C2.1 CRYSTAL1.1 U23.13(XTAL1) ; port XTAL1
XTAL1_AR: C8.1 CRYSTAL2.1 U33.9(PB6_XTAL1) ; port XTAL1_AR
XTAL2: C3.1 CRYSTAL1.2 U23.12(XTAL2) ; port XTAL2
XTAL2_AR: C7.1 CRYSTAL2.2 U33.10(PB7_XTAL2) ; port XTAL2_AR
Net3V3_1: 3V3.1(+) R3.2
Net4V_1: 4V.1(+) R4.2
Net5V_1: 5V.1(+) R6.2
Net12V_1: 12V.1(+) R8.2
NetAVR_CAN_CS: AVR_CAN.CS(3) AVR_DIP_SWITCHES.1
NetAVR_CAN_MISO: AVR_CAN.MISO(5) AVR_DIP_SWITCHES.3
NetAVR_CAN_SCK: AVR_CAN.SCK(6) AVR_DIP_SWITCHES.4
NetC4_2: C4.2 U23.32(AREF)
NetC15_2: C15.2 K1.1 U19.2(K) U20.3(OUT)
NetCHR_1: CHR.1(+) R10.2
NetK2_2: K2.2 Q1.3(C) U34.1(A)
NetK3_2: K3.2 Q4.3(C) U26.1(A)
NetNV5V_1: NV5V.1(+) R9.2
NetQ1_2: Q1.2(B) R1.2
NetQ2_2: Q2.2(B) R22.1
NetQ3_2: Q3.2(B) R26.1
NetQ3_3: Q3.3(C) Q5.1(E)
NetQ4_2: Q4.2(B) R7.2
NetQ5_2: Q5.2(B) R27.1
NetR1_1: R1.1 U40.3(EM)
NetR2_2: R2.2 U40.1(AN)
NetR5_2: R5.2 U24.1(AN)
NetR7_1: R7.1 U24.3(EM)
NetR17_1: R17.1 U3.10(OE)
NetR19_2: R19.2 UL_LOGIC_CON_1.10(OE)
NetR20_2: R20.2 UL_LOGIC_CON_2.10(OE)
NetR23_1: R23.1 R24.2 U4.7(DIS)
NetR24_1: R24.1 U4.2(RTIG) U4.6(CONTH) U5.1
NetRN5V_1: RN5V.1(+) U24.2(CAT)
NetS1_3: S1.3(S) U20.1(IN)
NetU40_2: U40.2(CAT) U41.1(+)
NetU63_1: U63.1(VCC) ULTRA_1_EXT.4
NetU63_2: U63.2(Trig) ULTRA_1_EXT.3
NetU63_3: U63.3(Echo) ULTRA_1_EXT.2
NetU63_4: U63.4(GND) ULTRA_1_EXT.1
NetU64_1: U64.1(VCC) ULTRA_9_EXT.4
NetU64_2: U64.2(Trig) ULTRA_9_EXT.3
NetU64_3: U64.3(Echo) ULTRA_9_EXT.2
NetU64_4: U64.4(GND) ULTRA_9_EXT.1
NetU65_1: U65.1(VCC) ULTRA_10_EXT.4
NetU65_2: U65.2(Trig) ULTRA_10_EXT.3
NetU65_3: U65.3(Echo) ULTRA_10_EXT.2
NetU65_4: U65.4(GND) ULTRA_10_EXT.1
NetU66_1: U66.1(VCC) ULRTA_2_EXT.4
NetU66_2: U66.2(Trig) ULRTA_2_EXT.3
NetU66_3: U66.3(Echo) ULRTA_2_EXT.2
NetU66_4: U66.4(GND) ULRTA_2_EXT.1
NetU67_1: U67.1(VCC) ULTRA_11_EXT.4
NetU67_2: U67.2(Trig) ULTRA_11_EXT.3
NetU67_3: U67.3(Echo) ULTRA_11_EXT.2
NetU68_1: U68.1(VCC) ULTRA_12_EXT.4
NetU68_2: U68.2(Trig) ULTRA_12_EXT.3
NetU68_3: U68.3(Echo) ULTRA_12_EXT.2
NetU68_4: U68.4(GND) ULTRA_12_EXT.1
NetU69_1: U69.1(VCC) ULTRA_13_EXT.4
NetU69_2: U69.2(Trig) ULTRA_13_EXT.3
NetU69_3: U69.3(Echo) ULTRA_13_EXT.2
NetU69_4: U69.4(GND) ULTRA_13_EXT.1
NetU70_1: U70.1(VCC) ULTRA_14_EXT.4
NetU70_2: U70.2(Trig) ULTRA_14_EXT.3
NetU70_3: U70.3(Echo) ULTRA_14_EXT.2
NetU70_4: U70.4(GND) ULTRA_14_EXT.1

Not connected (* = marked no-connect by the designer): 1 1(STATE) 6(EN); AVR_BURNER 3 4 6 8; AVR_CAN INT(7) MOSI(4); AVR_DIP_SWITCHES 2; DATA_BUS_UL 9 11 12 13 14 16; H1 5(XDA) 6(XCL) 7(ADO) 8(INT); K1 3; K2 1 3; K3 3; LESO 3.3V_2 5V B9 B14 B15 C13 C14 C15 GND_2 GND_3 R VB; LIDAR1 3.3V_2 5V A15 B0 B1 B3 B4 B5 B7 B8 B9 B10 B11 B12 B13 B14 B15 C13 C14 C15 GND_1 GND_3 R VB; LIL_DATA_BUS 2 3 4 5 6 7 8 9 10 11 12 13 15 16; LIL_POWER_BUS 7 8 15 16; M1 3(RST) 6(RING) 7(DTR) 8(MICP) 9(MICN) 10(SPKP) 11(SPKN); M2 2(CTS) 3(VCC) 6(DTR); M3 2(CTS) 3(VCC) 6(DTR); M4 3(5V); MC_CAN 1(CANH) 2(CANL); MC_DATA_BUS 1 8 11 13; MC_POWER_BUS 5 6 7 8 13 14 15 16; MC_TTL 2(CTS) 3(VCC) 6(GND_DTR); MK1 7(IRQ); MK2 7(IRQ); ML_DATA_BUS 1 4 5 6 7 9 10 11 12 13 14 15; MOTION_CORE1 3.3V_2 5V B0 B1 B3 B4 B5 B8 B9 B13 B14 B15 C13 C14 C15 GND_2 GND_3 R VB; PL_DATA_BUS 2 3 4 5 6 7 8 10 11 12 13 14 15 16; POWER_BUS_UL 5 6 7 8 13 14 15 16; S1 1(O); S2 1(O); STM_ML_TTL 2(CTS) 3(VCC) 6(GND_DTR); U2 10(T_CLK) 11(T_CS) 12(T_DIN) 13(T_DO) 14(T_IRQ); U3 9(A8) 12(B8); U4 5(CONTRIG); U6 1(CANH) 2(CANL); U7 2(CTS) 3(VCC) 6(GND_DTR); U23 1(PB0) 2(PB1) 3(PB2) 14(PD0) 15(PD1) 16(PD2) 17(PD3) 18(PD4) 19(PD5) 20(PD6) 21(PD7) 24(PC2) 25(PC3) 26(PC4) 27(PC5) 28(PC6) 29(PC7) 33(PA7) 34(PA6) 35(PA5) 36(PA4) 37(PA3) 39(PA1) 40(PA0); U33 6(T0_PD4) 11(T1_PD5) 12(AIN0_PD6) 13(AIN1_PD7) 14(PCINT0_PB0) 15(PCINT1__PB1) 16(PCINT2_PB2) 17(PCINT3_PB3) 18(PCINT4_PB4) 19(PCINT5_PB5) 21(AREF) 23(PC0_ADC0) 24(PC1_ADC1) 25(PC2_ADC2) 26(PC3_ADC3) 27(PC4_ADC4) 28(PC5_ADC5); U36 4(UART) 5(PDN) 6(CLK) 17(INDEX); U45 2(CTS) 3(VCC) 6(GND_DTR); U52 4(INT0_PD2) 5(INT1_PD3) 11(T1_PD5) 12(AIN0_PD6) 15(PCINT1__PB1) 16(PCINT2_PB2) 21(AREF) 23(PC0_ADC0) 24(PC1_ADC1) 25(PC2_ADC2) 26(PC3_ADC3) 27(PC4_ADC4) 28(PC5_ADC5); U62 2(CTS) 3(VCC) 6(GND_DTR); UL_CAN 1(CANH) 2(CANL); UL_LOGIC_CON_2 6(A5) 7(A6) 8(A7) 9(A8) 12(B8) 13(B7) 14(B6) 15(B5); UL_TTL 2(CTS) 3(VCC) 6(GND_DTR); ULTRASONIC_CORE2 5V B5 B7 B8 B9 B10 B11 B12 B13 B14 B15 C13 C14 C15 GND_2 GND_3 VB

## Notes on the sheet
- LIDAR
- LAYER
- FT232RL
- MAIN CORE LAYER
- EXTERNAL
- CONNECTOR
- ULTRASONIC
- NVIDIA_BUCK1
- (in symbol 2S-BMS-LEGA) 2S-BMS-Lega
- (in symbol 3.2"TFT WITHOUT SD CARD) LCD; TOUCH; ILI9341 3.2 Inch TFT v1.1; ILI9341 3.2; U5
- (in symbol CAN Bus Module TJA1050) CAN BUS MODULE
- (in symbol CAN MODULE -UGE- xsola) UGE_CAN
- (in symbol Conector moles 6 pines USB TO SERIAL) AR_TTL
- (in symbol FT232RL COPY) FT232RL
- (in symbol SW_DIP-2) ON

## Library data of the parts
1 = WIRELESS-BLUETOOTH-HC-05: Contributor: olgri; spicePre: ?; spiceSymbolName: WIRELESS-BLUETOOTH-HC-05
3V3 4V 5V 12V CHR NV5V RN5V U41 = 5MM LED: Manufacturer: null; Manufacturer Part: 5mm LED 雾发红; Contributor: lcsc; Supplier: LCSC; Supplier Part: C9900034380; JLCPCB Part Class: Extended Part; spicePre: U; spiceSymbolName: 5MM LED 雾发红
12V_BOOST = XL6009E1_STEP_UP: Contributor: adamambarus; spicePre: U; spiceSymbolName: XL6009E1_STEP_UP
ANGLE_SELECTOR ANGLE_SELECTOR_2 BUZZER_CONNECTOR EXT_BATTERY LED_CONNECTOR LIMIT_SW NVIDIA_COM = XH2.54-2P_C9900015554: Manufacturer: null; Contributor: lcsc; Supplier: LCSC; Supplier Part: C9900015554; Manufacturer Part: XH2.54-2P; JLCPCB Part Class: Extended Part; spicePre: C; spiceSymbolName: XH2.54-2P_C9900015554
AVR_BURNER = ZX-IDC2.54-2-5PWZ: Manufacturer: Megastar(兆星); Contributor: lcsc; Supplier: LCSC; Supplier Part: C7501250; Manufacturer Part: ZX-IDC2.54-2-5PWZ; spicePre: U; spiceSymbolName: ZX-IDC2.54-2-5PWZ
AVR_CAN = CAN Bus Module TJA1050: Contributor: finnspeed; Supplier Part: undefined; spicePre: U; spiceSymbolName: CAN Bus Module TJA1050
AVR_DIP_SWITCHES = DIP switchEI-04: Manufacturer: 圜达; Manufacturer Part: 拨码开关EI-04; Supplier: LCSC; Supplier Part: C99987; JLCPCB Part Class: Extended Part; spicePre: S; spiceSymbolName: DIP switchEI-04
BATTERY_CHARGER_BUCK SYSTEM_4V_POWER_BUCK = DC-DC-STEP-DOWN-LM2596: Contributor: yanniel; spicePre: ?; spiceSymbolName: DC-DC-STEP-DOWN-LM2596
BATTERY_CHARGER_JACK NVIDIA_EXT_P NVIDIA_JACK_OUT = CON_DC_M-DC_PTH2: description: DC power connector; Contributor: DangerousPrototype; spicePre: J; spiceSymbolName: CON_DC_M-DC_PTH2
BATTERY_CONNECTOR1 = 282815-3: Manufacturer: TE Connectivity(泰科电子); Contributor: lcsc; Supplier: LCSC; Supplier Part: C3009947; Manufacturer Part: 282815-3; JLCPCB Part Class: Extended Part; spicePre: U; spiceSymbolName: 282815-3
BMS = 2S-BMS-LEGA: Contributor: mostafaayman; spicePre: U; spiceSymbolName: 2S-BMS-LEGA
C1 C4-C6 C9-C11 C14-C16 = 100nF: Manufacturer: KEMET(基美); Manufacturer Part: C315C330KAG5TA; Contributor: LCSC; nameAlias: Value; Supplier: LCSC; Supplier Part: C1628627; JLCPCB Part Class: Extended Part; spicePre: C; spiceSymbolName: C315C330KAG5TA
C2 C3 C7 C8 C12 C13 = 33pF: Manufacturer: KEMET(基美); Manufacturer Part: C315C330KAG5TA; Contributor: LCSC; nameAlias: Value; Supplier: LCSC; Supplier Part: C1628627; JLCPCB Part Class: Extended Part; spicePre: C; spiceSymbolName: C315C330KAG5TA
CN1 = M2020V-2X2P: Manufacturer: XFCN(兴飞); Contributor: LCSC; Supplier: LCSC; Supplier Part: C492557; Manufacturer Part: M2020V-2x2P; JLCPCB Part Class: Extended Part; spicePre: C; spiceSymbolName: M2020V-2X2P
CRYSTAL1-CRYSTAL3 = 16MHz: Manufacturer: HUAXIN(华昕); Manufacturer Part: SP2016M00009001; nameAlias: Value; Contributor: lcsc; Supplier: LCSC; Supplier Part: C7294720; spicePre: C; spiceSymbolName: SP2016M00009001
DATA_BUS_UL LIL_DATA_BUS LIL_POWER_BUS MC_DATA_BUS MC_POWER_BUS ML_DATA_BUS ML_POWER_BUS PL_DATA_BUS PL_POWER_BUS POWER_BUS_UL = ZX-IDC2.54-2-8PWZ: Manufacturer: Megastar(兆星); Contributor: lcsc; Supplier: LCSC; Supplier Part: C7501252; Manufacturer Part: ZX-IDC2.54-2-8PWZ; spicePre: U; spiceSymbolName: ZX-IDC2.54-2-8PWZ
GLOBAL_5V GSM_BUCK NVIDIA_BUCK = DC-DC-STEP-DOWN-XL4015: Contributor: MrOCW; spicePre: ?; spiceSymbolName: DC-DC-STEP-DOWN-XL4015
H1 = MPU 6050: Contributor: Andrushecka; Supplier Part: C225505; Supplier: LCSC; spicePre: H; spiceSymbolName: MPU 6050
K1-K3 = HK3FF-DC5V-SHG: Manufacturer: 汇科; Supplier: LCSC; Manufacturer Part: HK3FF-DC5V-SHG; Supplier Part: C27840; JLCPCB Part Class: Extended Part; spicePre: K; spiceSymbolName: HK3FF-DC5V-SHG
KEY1-KEY4 = button6*6*8: Manufacturer: ReliaPro; Supplier Part: C59982; Supplier: LCSC; Manufacturer Part: button6*6*8; JLCPCB Part Class: Extended Part; spicePre: K; spiceSymbolName: button6*6*8
LEFT_M_CONNECTOR RIGHT_M_CONNECTOR = JST_1x6_male: Manufacturer: BOOMELE; Manufacturer Part: Header-Male-2.54_1x6; SMT Type: Extend; Paste Type: expand; Contributor: siva techuva; Supplier: LCSC; Supplier Part: C37208; LCSC Assembly: Yes; Assembly Type: manualWeld; spicePre: J; spiceSymbolName: JST_1x6_male
LESO LIDAR1 MOTION_CORE1 ULTRASONIC_CORE2 = STM32f103c8t6: Contributor: vadim_dobrunin; spicePre: U; spiceSymbolName: STM32f103c8t6
M1 = WAL: SIM800L MODULE: Contributor: WA; Manufacturer Part: SIM800L; link: https://img.filipeflop.com/files/download/Datasheet_SIM800L.pdf; spicePre: M; spiceSymbolName: WAL: SIM800L MODULE
M2 M3 = FT232RL COPY: Contributor: luis.esc045; Supplier: LuisE; spicePre: M; spiceSymbolName: FT232RL COPY
M4 = L298N Motor Driver: Contributor: hawary.ischool; spicePre: M; spiceSymbolName: L298N Motor Driver
MC_CAN U6 UL_CAN = CAN MODULE -UGE- xsola: Contributor: mostafaayman; spicePre: U; spiceSymbolName: CAN MODULE -UGE- xsola
MC_TTL STM_ML_TTL U7 U45 U62 UL_TTL = Conector moles 6 pines USB TO SERIAL: Manufacturer: ADAFRUIT; Manufacturer Part: 22053061; Contributor: andres66; Supplier: NEWARK; Supplier Part: FT232RL; link: https://www.amazon.com/-/es/3-3V-FT232RL-adaptador-serie-módulo/dp/B07QJX9FYY; spicePre: U; spiceSymbolName: Conector moles 6 pines USB TO SERIAL
MK1 MK2 = NRF24L01: Manufacturer: Ai-Thinker(安信可); Manufacturer Part: NF-04; Supplier: LCSC; Supplier Part: C90751; JLCPCB Part Class: Extended Part; spicePre: M; spiceSymbolName: NRF24L01
MODULE2 = UBLOX NEO 6M GPS MODULE NO-ANTENNA: Contributor: adudakov; spicePre: M; spiceSymbolName: UBLOX NEO 6M GPS MODULE NO-ANTENNA
P1 = SERVO_CONNECTOR: Manufacturer: BOOMELE(博穆精密); Manufacturer Part: 2.54-1*3P母; Supplier Part: C146243; Supplier: LCSC; JLCPCB Part Class: Extended Part; spicePre: P; spiceSymbolName: Header-Female-2.54_1x3
P3 = Header-Male-2.54_2x4: Manufacturer: BOOMELE(博穆精密); Manufacturer Part: 直排针2X4P 2.54mm; Supplier: LCSC; Supplier Part: C58363; JLCPCB Part Class: Extended Part; spicePre: P; spiceSymbolName: Header-Male-2.54_2x4
Q1 Q4 = 2N3904: Manufacturer: ST(先科); Supplier: LCSC; Manufacturer Part: 2N3904; Supplier Part: C118538; JLCPCB Part Class: Extended Part; spicePre: Q; spiceSymbolName: 2N3904
Q2 Q3 Q5 = 2N2222N: Manufacturer: BLUE ROCKET(蓝箭); Manufacturer Part: 2N2222A; Contributor: Lee Smith; Supplier: LCSC; Supplier Part: C358533; JLCPCB Part Class: Extended Part; spicePre: Q; spiceSymbolName: 2N2222N
R1 R3 R4 R6-R10 R12-R18 = 220R: Contributor: canarywood; spicePre: R; spiceSymbolName: 1.0K
R2 R5 = 100R: Contributor: canarywood; spicePre: R; spiceSymbolName: 1.0K
R11 R19-R21 R23-R25 = 10K: Contributor: canarywood; spicePre: R; spiceSymbolName: 1.0K
R22 R26 R27 = 4K7: Contributor: canarywood; spicePre: R; spiceSymbolName: 1.0K
REMOTE_POWER STEPPER_CONNECTOR_1 STEPPER_CONNECTOR_2 = CON_TERMINAL_BLOCK_02: Contributor: DangerousPrototype; spicePre: J; spiceSymbolName: CON_TERMINAL_BLOCK_02
S1 S2 = SWITCH-SPDT: Contributor: SparkFun; spicePre: S; spiceSymbolName: SWITCH-SPDT
SW1 SW2 = SW_DIP-2: description: DIP SWITCH; Contributor: SparkFun; spicePre: S; spiceSymbolName: SW_DIP-2
U1 = LD1117V33: Manufacturer: ST(意法半导体); Contributor: LCSC; Supplier: LCSC; Supplier Part: C283467; Manufacturer Part: LD1117V33; JLCPCB Part Class: Extended Part; spicePre: U; spiceSymbolName: LD1117V33
U2 = 3.2"TFT WITHOUT SD CARD: Contributor: manojndias; spicePre: U; spiceSymbolName: 3.2"TFT WITHOUT SD CARD
U3 UL_LOGIC_CON_1 UL_LOGIC_CON_2 = TXS0108E: Contributor: adrirobot; spicePre: U; spiceSymbolName: TXS0108E
U4 = NE555_C5157852: Manufacturer: Gcore(扬州国芯); Manufacturer Part: NE555; Contributor: lcsc; Supplier: LCSC; Supplier Part: C5157852; spicePre: U; spiceSymbolName: NE555_C5157852
U5 U37 U47 U55 U56 = 1000uF: Manufacturer: HRK(鸿瑞凯电子); Manufacturer Part: 25V1000uF CD288; Contributor: lcsc; nameAlias: Value; Supplier: LCSC; Supplier Part: C2960265; JLCPCB Part Class: Extended Part; spicePre: U; spiceSymbolName: 25V1000UFCD288
U18 U19 U26 U34 = 1N4007-DIODE: Manufacturer: null; Contributor: LCSC; Supplier: LCSC; Supplier Part: C9900005663; Manufacturer Part: 1N4007-DIODE; JLCPCB Part Class: Extended Part; spicePre: U; spiceSymbolName: 1N4007-DIODE
U20 U42 = 7805: Manufacturer: BLUE ROCKET(蓝箭); Contributor: LCSC; Supplier: LCSC; Supplier Part: C305416; Manufacturer Part: 7805; JLCPCB Part Class: Extended Part; spicePre: U; spiceSymbolName: 7805
U23 = ATMEGA32L-8PU: Manufacturer: MICROCHIP(美国微芯); Contributor: LCSC; Supplier: LCSC; Supplier Part: C1337661; Manufacturer Part: ATMEGA32L-8PU; JLCPCB Part Class: Extended Part; spicePre: U; spiceSymbolName: ATMEGA32L-8PU
U24 U40 = CYPC817: Manufacturer: OCIC(卓睿科); Manufacturer Part: CYPC817B; Contributor: LCSC; Supplier: LCSC; Supplier Part: C385061; JLCPCB Part Class: Extended Part; spicePre: U; spiceSymbolName: CYPC817
U33 U52 = ATMEGA328P-PU: Manufacturer: MICROCHIP(美国微芯); sourceId: Oic6oiASL; Contributor: LCSC; timeStamp: 1451725987; Supplier: LCSC; Manufacturer Part: ATMEGA328P-PU; Supplier Part: C33901; JLCPCB Part Class: Extended Part; spicePre: U; spiceSymbolName: ATMEGA328P-PU
U36 = TMC2208: Contributor: overprint official korea; spicePre: U; spiceSymbolName: TMC2208
U59 = 4 Way Bi-Directional Logic Level Converter: Manufacturer Part: New SchematicLib; Contributor: Jonathan Symon (YOTTAZOID); spicePre: U; spiceSymbolName: 4 Way Bi-Directional Logic Level Converter
U63-U70 = HC04: Contributor: skt71102; spicePre: U; spiceSymbolName: HC04
ULRTA_1 ULRTA_2_EXT ULTRA_1_EXT ULTRA_2-ULTRA_8 ULTRA_9_EXT ULTRA_10_EXT ULTRA_11_EXT ULTRA_12_EXT ULTRA_13_EXT ULTRA_14_EXT = JST-XH2.54 4P: Contributor: marierigal4; Supplier: CQRobot; Supplier Part: JST-XH2.54 4P; link: https://www.amazon.fr/dp/B01EQGNZ2I/?coliid=IQPWZUUK7M1P0&colid=2CFFEVMK4YZ12&ref_=lv_ov_lig_dp_it_im&th=1; spicePre: C; spiceSymbolName: JST-XH2.54 4P